# Altium project S7CAS-PLEIADES-CARTE-MERE_P20.PrjPcb (part 2 of 5)

## Sheet S7CAS-PLEIADES-CARTE-MERE_P20_DDR3-Decoupling.SchDoc
size Tabloid; SheetNumber: 7; SheetTotal: 20; Sheet_Name: DDR3 Decoupling; Size: 11x17
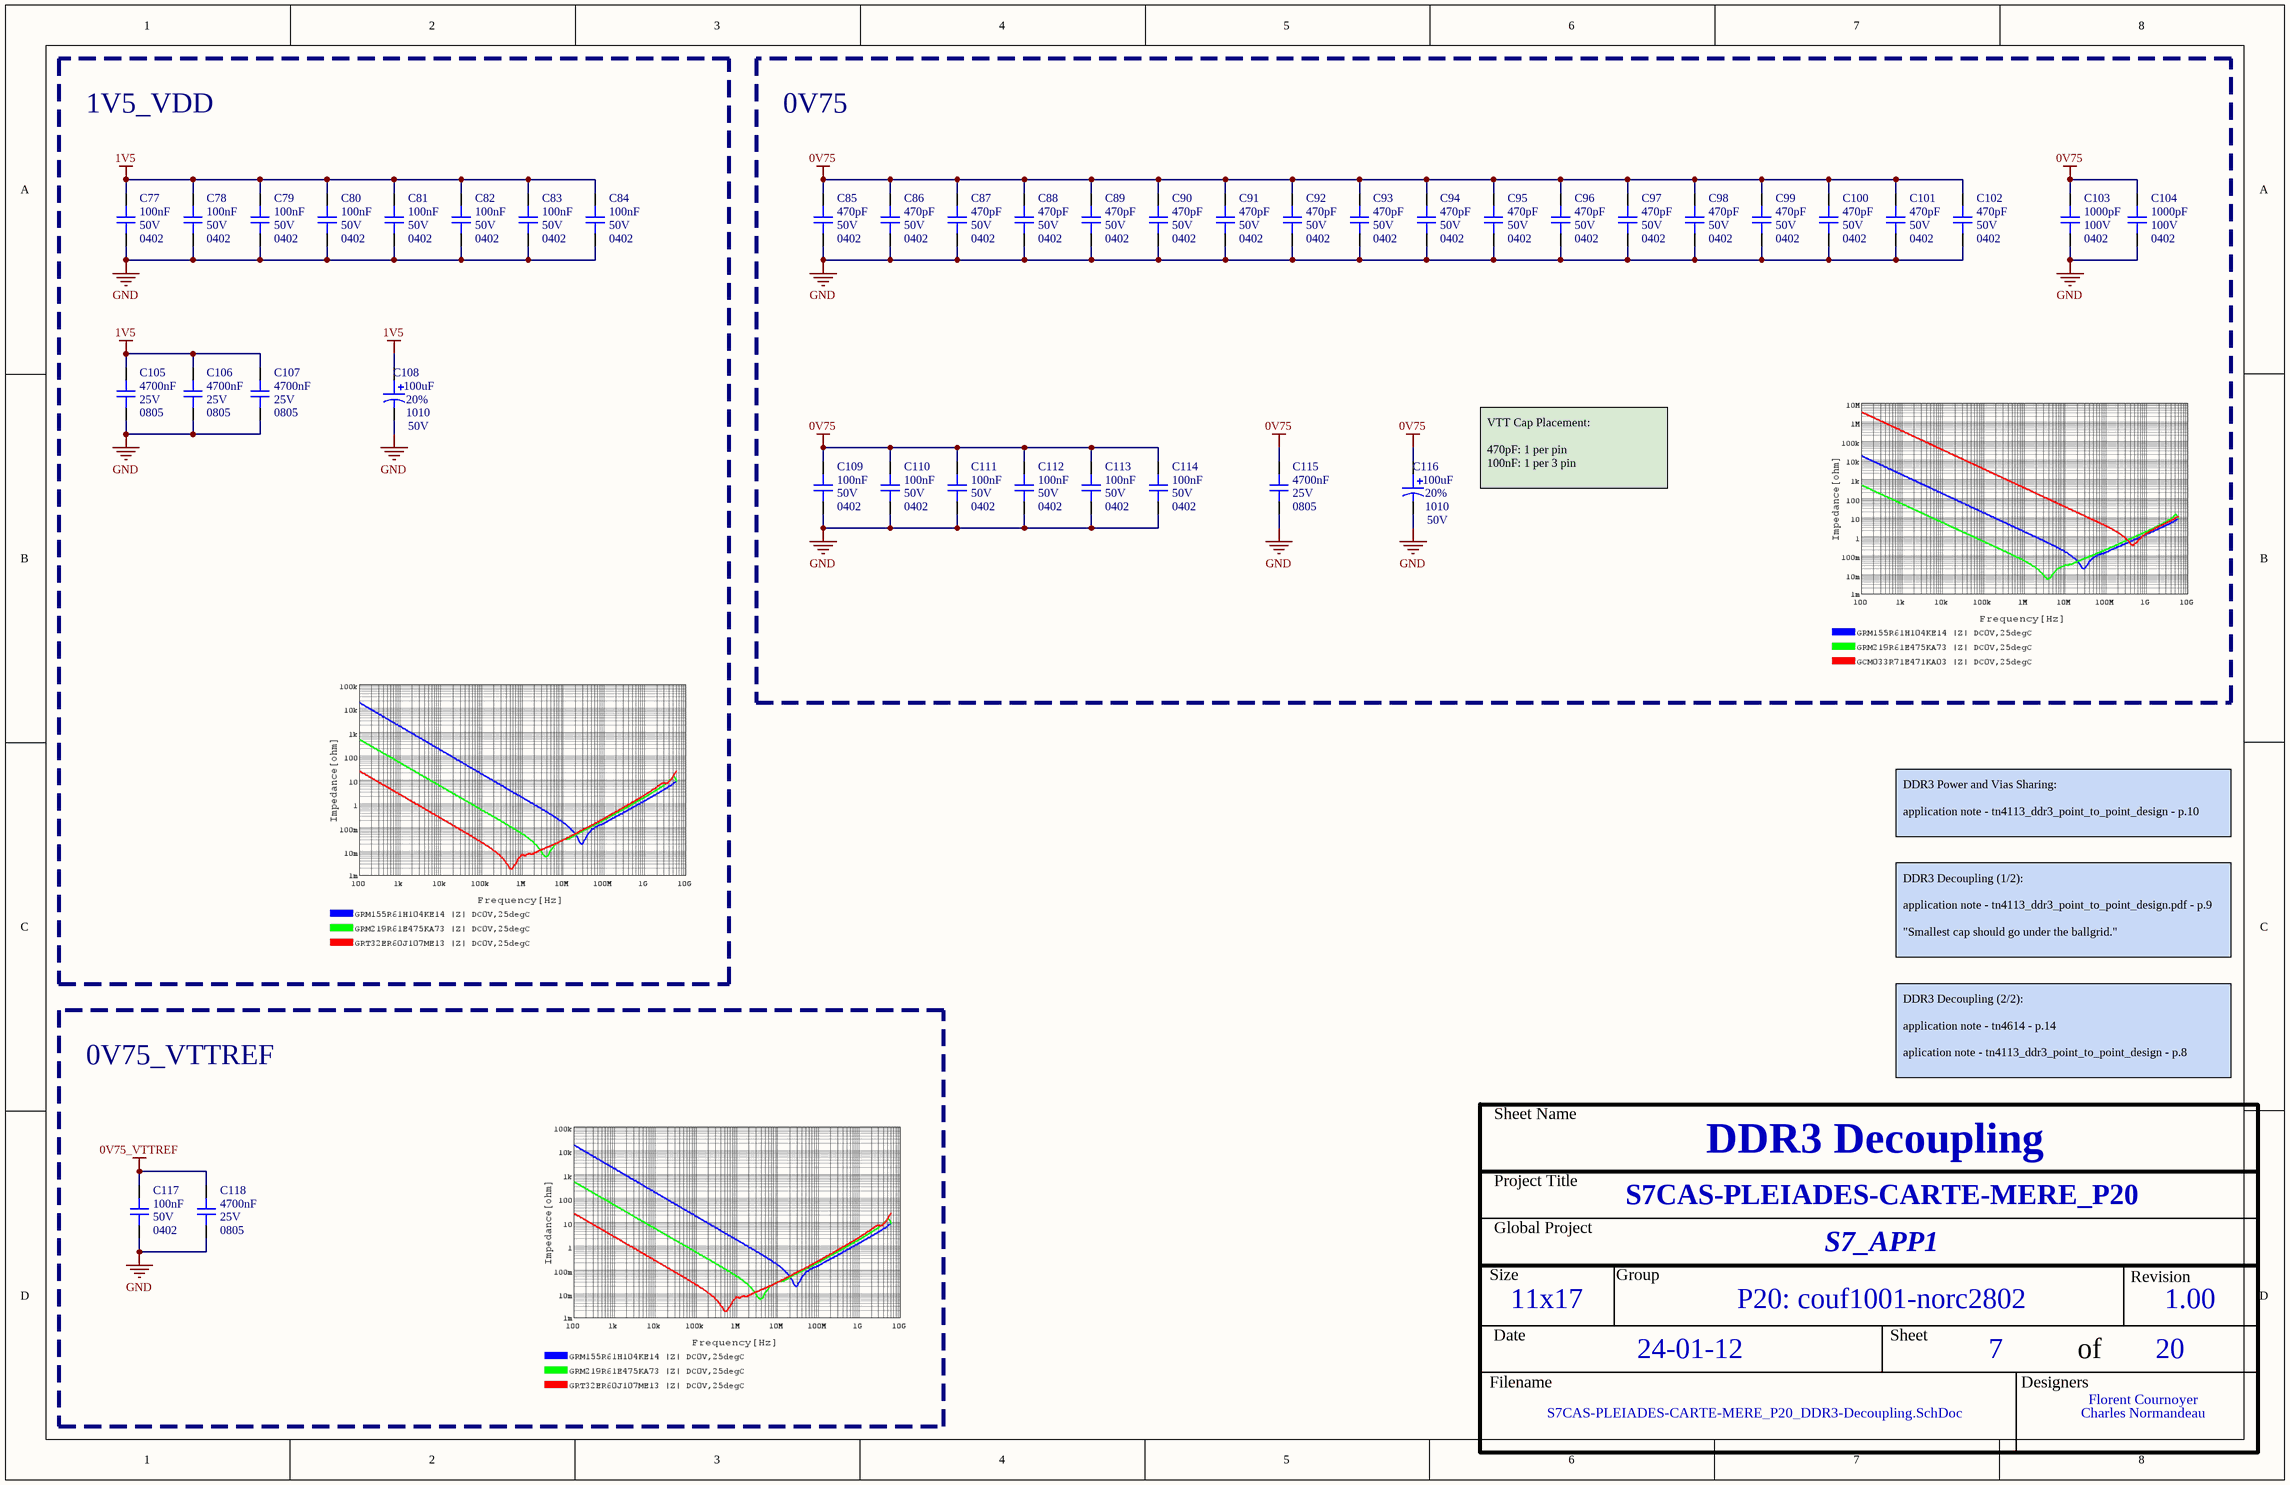
[diagram p6: S7CAS-PLEIADES-CARTE-MERE_P20_DDR3-Decoupling.SchDoc]

### Parts
C77  value 100nF  Voltage: 50V  Package: 0402  [CAP_0402]  (hidden comment: CAP - 0402)
C78  value 100nF  Voltage: 50V  Package: 0402  [CAP_0402]  (hidden comment: CAP - 0402)
C79  value 100nF  Voltage: 50V  Package: 0402  [CAP_0402]  (hidden comment: CAP - 0402)
C80  value 100nF  Voltage: 50V  Package: 0402  [CAP_0402]  (hidden comment: CAP - 0402)
C81  value 100nF  Voltage: 50V  Package: 0402  [CAP_0402]  (hidden comment: CAP - 0402)
C82  value 100nF  Voltage: 50V  Package: 0402  [CAP_0402]  (hidden comment: CAP - 0402)
C83  value 100nF  Voltage: 50V  Package: 0402  [CAP_0402]  (hidden comment: CAP - 0402)
C84  value 100nF  Voltage: 50V  Package: 0402  [CAP_0402]  (hidden comment: CAP - 0402)
C85  value 470pF  Voltage: 50V  Package: 0402  [CAP_0402]  (hidden comment: CAP - 0402)
C86  value 470pF  Voltage: 50V  Package: 0402  [CAP_0402]  (hidden comment: CAP - 0402)
C87  value 470pF  Voltage: 50V  Package: 0402  [CAP_0402]  (hidden comment: CAP - 0402)
C88  value 470pF  Voltage: 50V  Package: 0402  [CAP_0402]  (hidden comment: CAP - 0402)
C89  value 470pF  Voltage: 50V  Package: 0402  [CAP_0402]  (hidden comment: CAP - 0402)
C90  value 470pF  Voltage: 50V  Package: 0402  [CAP_0402]  (hidden comment: CAP - 0402)
C91  value 470pF  Voltage: 50V  Package: 0402  [CAP_0402]  (hidden comment: CAP - 0402)
C92  value 470pF  Voltage: 50V  Package: 0402  [CAP_0402]  (hidden comment: CAP - 0402)
C93  value 470pF  Voltage: 50V  Package: 0402  [CAP_0402]  (hidden comment: CAP - 0402)
C94  value 470pF  Voltage: 50V  Package: 0402  [CAP_0402]  (hidden comment: CAP - 0402)
C95  value 470pF  Voltage: 50V  Package: 0402  [CAP_0402]  (hidden comment: CAP - 0402)
C96  value 470pF  Voltage: 50V  Package: 0402  [CAP_0402]  (hidden comment: CAP - 0402)
C97  value 470pF  Voltage: 50V  Package: 0402  [CAP_0402]  (hidden comment: CAP - 0402)
C98  value 470pF  Voltage: 50V  Package: 0402  [CAP_0402]  (hidden comment: CAP - 0402)
C99  value 470pF  Voltage: 50V  Package: 0402  [CAP_0402]  (hidden comment: CAP - 0402)
C100  value 470pF  Voltage: 50V  Package: 0402  [CAP_0402]  (hidden comment: CAP - 0402)
C101  value 470pF  Voltage: 50V  Package: 0402  [CAP_0402]  (hidden comment: CAP - 0402)
C102  value 470pF  Voltage: 50V  Package: 0402  [CAP_0402]  (hidden comment: CAP - 0402)
C103  value 1000pF  Voltage: 100V  Package: 0402  [CAP_0402]  (hidden comment: CAP - 0402)
C104  value 1000pF  Voltage: 100V  Package: 0402  [CAP_0402]  (hidden comment: CAP - 0402)
C105  value 4700nF  Voltage: 25V  Package: 0805  [CAP_0805]  (hidden comment: CAP - 0805)
C106  value 4700nF  Voltage: 25V  Package: 0805  [CAP_0805]  (hidden comment: CAP - 0805)
C107  value 4700nF  Voltage: 25V  Package: 0805  [CAP_0805]  (hidden comment: CAP - 0805)
C108  value 100uF  Voltage: 50V  Package: 1010  Precision: 20%  [CAP_ALU_1010_vishay]  (hidden comment: MAL215099101E3)
C109  value 100nF  Voltage: 50V  Package: 0402  [CAP_0402]  (hidden comment: CAP - 0402)
C110  value 100nF  Voltage: 50V  Package: 0402  [CAP_0402]  (hidden comment: CAP - 0402)
C111  value 100nF  Voltage: 50V  Package: 0402  [CAP_0402]  (hidden comment: CAP - 0402)
C112  value 100nF  Voltage: 50V  Package: 0402  [CAP_0402]  (hidden comment: CAP - 0402)
C113  value 100nF  Voltage: 50V  Package: 0402  [CAP_0402]  (hidden comment: CAP - 0402)
C114  value 100nF  Voltage: 50V  Package: 0402  [CAP_0402]  (hidden comment: CAP - 0402)
C115  value 4700nF  Voltage: 25V  Package: 0805  [CAP_0805]  (hidden comment: CAP - 0805)
C116  value 100uF  Voltage: 50V  Package: 1010  Precision: 20%  [CAP_ALU_1010_vishay]  (hidden comment: MAL215099101E3)
C117  value 100nF  Voltage: 50V  Package: 0402  [CAP_0402]  (hidden comment: CAP - 0402)
C118  value 4700nF  Voltage: 25V  Package: 0805  [CAP_0805]  (hidden comment: CAP - 0805)

### Blocks framed on the sheet
1V5_VDD: C77-C84 C105-C108
0V75: C85-C104 C109-C116
0V75_VTTREF: C117 C118

### Nets
0V75: C85.2 C86.2 C87.2 C88.2 C89.2 C90.2 C91.2 C92.2 C93.2 C94.2 C95.2 C96.2 C97.2 C98.2 C99.2 C100.2 C101.2 C102.2 C103.2 C104.2 C109.2 C110.2 C111.2 C112.2 C113.2 C114.2 C115.2 C116.1
0V75_VTTREF: C117.2 C118.2
1V5: C77.2 C78.2 C79.2 C80.2 C81.2 C82.2 C83.2 C84.2 C105.2 C106.2 C107.2 C108.1
GND: C77.1 C78.1 C79.1 C80.1 C81.1 C82.1 C83.1 C84.1 C85.1 C86.1 C87.1 C88.1 C89.1 C90.1 C91.1 C92.1 C93.1 C94.1 C95.1 C96.1 C97.1 C98.1 C99.1 C100.1 C101.1 C102.1 C103.1 C104.1 C105.1 C106.1 C107.1 C108.2 C109.1 C110.1 C111.1 C112.1 C113.1 C114.1 C115.1 C116.2 C117.1 C118.1

### Notes on the sheet
- VTT Cap Placement:
  470pF: 1 per pin
  100nF: 1 per 3 pin
- DDR3 Power and Vias Sharing:
  application note - tn4113_ddr3_point_to_point_design - p.10
- DDR3 Decoupling (1/2):
  application note - tn4113_ddr3_point_to_point_design.pdf - p.9
  "Smallest cap should go under the ballgrid."
- DDR3 Decoupling (2/2):
  application note - tn4614 - p.14
  aplication note - tn4113_ddr3_point_to_point_design - p.8
- Sheet Name
- Project Title
- Global Project
- Size
- Group
- Revision
- Date
- Sheet
- of
- Filename
- Designers

### Library data of the parts
C77-C84 C109-C114 C117 = CAP - 0402: Mfg Part Number: GRM155R61H104KE14; Precision: 10%; Current: *; CreatedBy: Jonathan Bouchard; Power: *
C85-C102 = CAP - 0402: Mfg Part Number: GRM1555C1H471GA01; Precision: 2%; Current: *; HelpURL: https://search.murata.co.jp/Ceramy/image/img/A01X/G101/ENG/GRM1555C1H471GA01-01.pdf; CreatedBy: Jonathan Bouchard; Power: *
C103 C104 = CAP - 0402: Mfg Part Number: GRM155R72A102KA01; Precision: 10%; Current: *; CreatedBy: Jonathan Bouchard; Power: *
C105-C107 C115 C118 = CAP - 0805: as C29 on sheet S7CAS-PLEIADES-CARTE-MERE_P20_Power-Tree-2; Current: *; CreatedBy: Jonathan Bouchard; Power: *
C108 C116 = CAP_ALU_MAL215099101E3: as C5 on sheet S7CAS-PLEIADES-CARTE-MERE_P20_Power-Tree-1; Mfg Part Number: MAL215099101E3; HelpURL: http://www.vishay.com/docs/28395/150crz.pdf; CreatedBy: Jonathan Bouchard; Temperature: -55°C to 125°C; Power: *; Supplier 1: Digikey; Supplier Part Number 1: 4399PHDKR-ND

## Sheet S7CAS-PLEIADES-CARTE-MERE_P20_Flash-Sensors-FPGA-bank-2.SchDoc
size Tabloid; SheetNumber: 8; SheetTotal: 20; Sheet_Name: Flash Sensors FPGA Bank 2; Size: 11x17
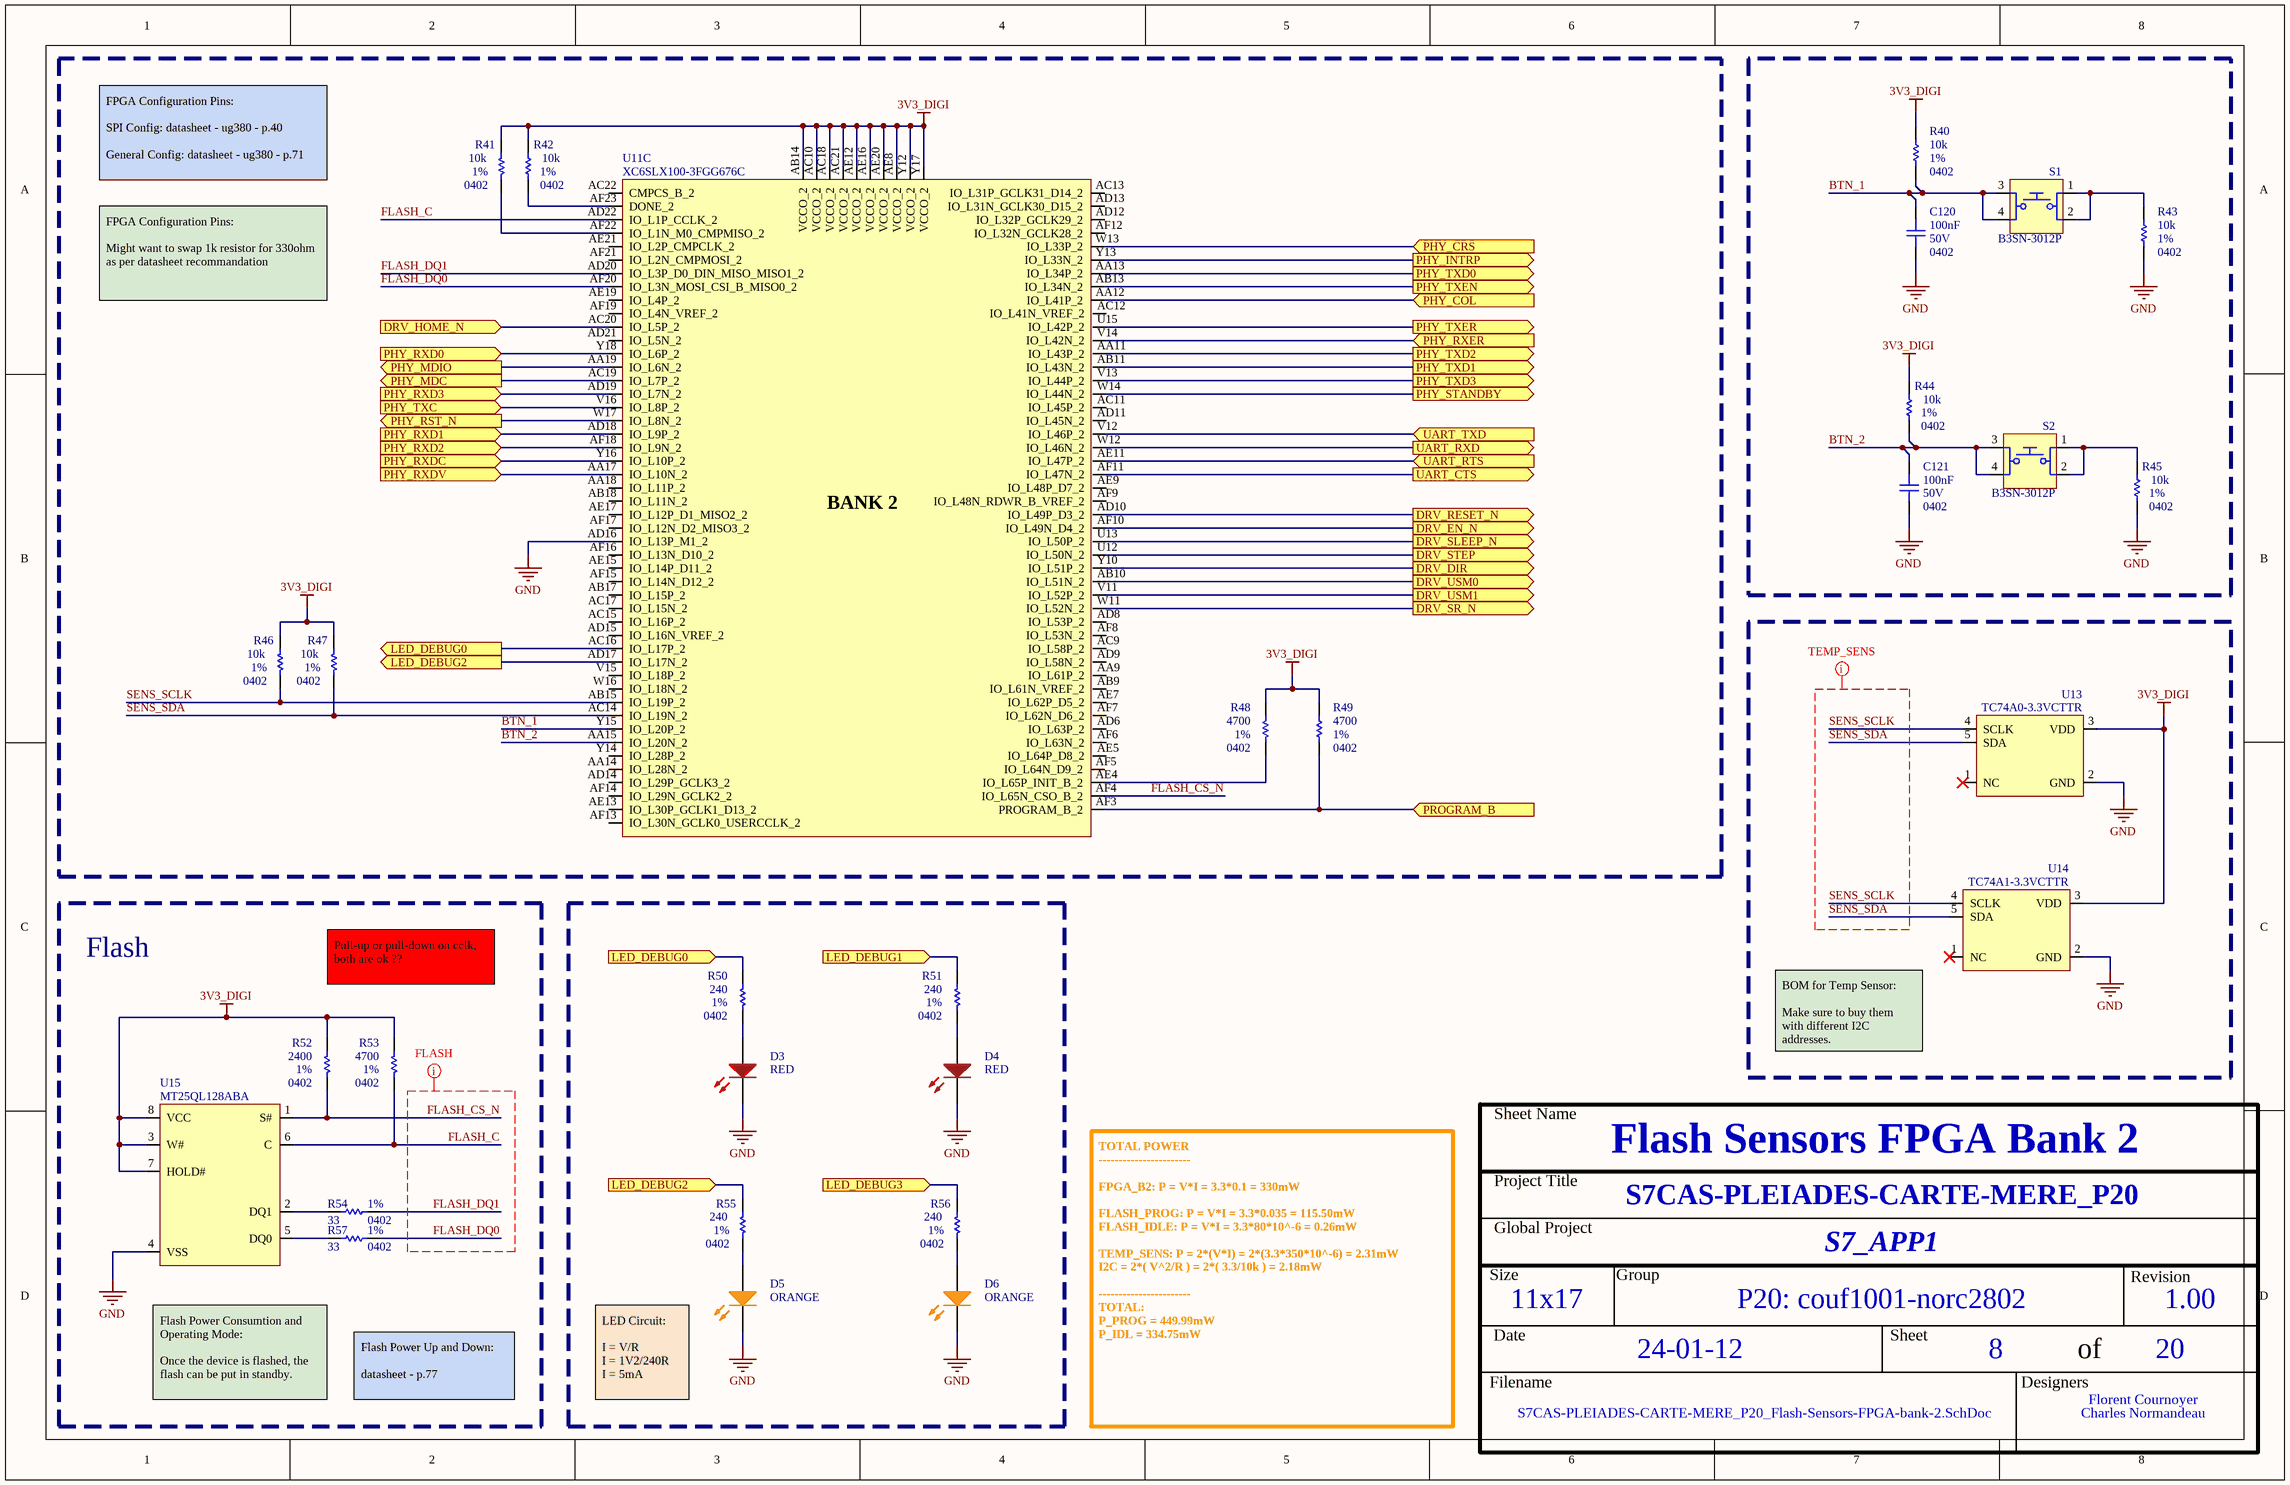
[diagram p7: S7CAS-PLEIADES-CARTE-MERE_P20_Flash-Sensors-FPGA-bank-2.SchDoc]

### Parts
C120  value 100nF  Voltage: 50V  Package: 0402  [CAP_0402]  (hidden comment: CAP - 0402)
C121  value 100nF  Voltage: 50V  Package: 0402  [CAP_0402]  (hidden comment: CAP - 0402)
D3  value RED  [LED_0603]  (hidden comment: SML-311UTT86)
D4  value RED  [LED_0603]  (hidden comment: SML-311UTT86)
D5  value ORANGE  [LED_0603]  (hidden comment: SML-311DTT86)
D6  value ORANGE  [LED_0603]  (hidden comment: SML-311DTT86)
R40  value 10k  Package: 0402  Precision: 1%  [RES_0402]  (hidden comment: RES - 0402)
R41  value 10k  Package: 0402  Precision: 1%  [RES_0402]  (hidden comment: RES - 0402)
R42  value 10k  Package: 0402  Precision: 1%  [RES_0402]  (hidden comment: RES - 0402)
R43  value 10k  Package: 0402  Precision: 1%  [RES_0402]  (hidden comment: RES - 0402)
R44  value 10k  Package: 0402  Precision: 1%  [RES_0402]  (hidden comment: RES - 0402)
R45  value 10k  Package: 0402  Precision: 1%  [RES_0402]  (hidden comment: RES - 0402)
R46  value 10k  Package: 0402  Precision: 1%  [RES_0402]  (hidden comment: RES - 0402)
R47  value 10k  Package: 0402  Precision: 1%  [RES_0402]  (hidden comment: RES - 0402)
R48  value 4700  Package: 0402  Precision: 1%  [RES_0402]  (hidden comment: RES - 0402)
R49  value 4700  Package: 0402  Precision: 1%  [RES_0402]  (hidden comment: RES - 0402)
R50  value 240  Package: 0402  Precision: 1%  [RES_0402]  (hidden comment: RES - 0402)
R51  value 240  Package: 0402  Precision: 1%  [RES_0402]  (hidden comment: RES - 0402)
R52  value 2400  Package: 0402  Precision: 1%  [RES_0402]  (hidden comment: RES - 0402)
R53  value 4700  Package: 0402  Precision: 1%  [RES_0402]  (hidden comment: RES - 0402)
R54  value 33  Package: 0402  Precision: 1%  [RES_0402]  (hidden comment: RES - 0402)
R55  value 240  Package: 0402  Precision: 1%  [RES_0402]  (hidden comment: RES - 0402)
R56  value 240  Package: 0402  Precision: 1%  [RES_0402]  (hidden comment: RES - 0402)
R57  value 33  Package: 0402  Precision: 1%  [RES_0402]  (hidden comment: RES - 0402)
S1  B3SN-3012P  [SWI_TACT_B3SN-3012P]
S2  B3SN-3012P  [SWI_TACT_B3SN-3012P]
U11  XC6SLX100-3FGG676C  [FPGA_XILINX_FGG676]  (part C of 10)
U13  TC74A0-3.3VCTTR  [SEN_TEMP_TC74A0-3.3VCTTR]
U14  TC74A1-3.3VCTTR  [SEN_TEMP_TC74A0-3.3VCTTR]
U15  MT25QL128ABA  [FLASH_MT25QL128ABA]

### Blocks framed on the sheet
Flash: R52-R54 R57 U15

### Ports
DRV_DIR (out), DRV_EN_N (out), DRV_HOME_N (in), DRV_RESET_N (out), DRV_SLEEP_N (out), DRV_SR_N (out), DRV_STEP (out), DRV_USM0 (out), DRV_USM1 (out), LED_DEBUG0 (in), LED_DEBUG0 (out), LED_DEBUG1 (in), LED_DEBUG2 (in), LED_DEBUG2 (out), LED_DEBUG3 (in), PHY_COL (in), PHY_CRS (in), PHY_INTRP (out), PHY_MDC (out), PHY_MDIO (out), PHY_RST_N (out), PHY_RXD0 (in), PHY_RXD1 (in), PHY_RXD2 (in), PHY_RXD3 (in), PHY_RXDC (in), PHY_RXDV (in), PHY_RXER (in), PHY_STANDBY (out), PHY_TXC (in), PHY_TXD0 (out), PHY_TXD1 (out), PHY_TXD2 (out), PHY_TXD3 (out), PHY_TXEN (out), PHY_TXER (out), PROGRAM_B (in), UART_CTS (out), UART_RTS (in), UART_RXD (out), UART_TXD (in)

### Nets
3V3_DIGI: R40.2 R41.2 R42.2 R44.2 R46.2 R47.2 R48.2 R49.2 R52.2 R53.2 U11.AB14(VCCO_2) U11.AC10(VCCO_2) U11.AC18(VCCO_2) U11.AC21(VCCO_2) U11.AE8(VCCO_2) U11.AE12(VCCO_2) U11.AE16(VCCO_2) U11.AE20(VCCO_2) U11.Y12(VCCO_2) U11.Y17(VCCO_2) U13.3(VDD) U14.3(VDD) U15.3(W#) U15.7(HOLD#) U15.8(VCC)
GND: C120.1 C121.1 D3.K D4.K D5.K D6.K R43.1 R45.1 U11.AD16(IO_L13P_M1_2) U13.2(GND) U14.2(GND) U15.4(VSS)
BTN_1: C120.2 R40.1 S1.3 S1.4 U11.Y15(IO_L20P_2)
BTN_2: C121.2 R44.1 S2.3 S2.4 U11.AA15(IO_L20N_2)
DRV_DIR: U11.Y10(IO_L51P_2) ; port DRV_DIR
DRV_EN_N: U11.AF10(IO_L49N_D4_2) ; port DRV_EN_N
DRV_HOME_N: U11.AC20(IO_L5P_2) ; port DRV_HOME_N
DRV_RESET_N: U11.AD10(IO_L49P_D3_2) ; port DRV_RESET_N
DRV_SLEEP_N: U11.U13(IO_L50P_2) ; port DRV_SLEEP_N
DRV_SR_N: U11.W11(IO_L52N_2) ; port DRV_SR_N
DRV_STEP: U11.U12(IO_L50N_2) ; port DRV_STEP
DRV_USM0: U11.AB10(IO_L51N_2) ; port DRV_USM0
DRV_USM1: U11.V11(IO_L52P_2) ; port DRV_USM1
FLASH_C: R53.1 U11.AD22(IO_L1P_CCLK_2) U15.6(C)
FLASH_CS_N: R52.1 U11.AF4(IO_L65N_CSO_B_2) U15.1(S#)
FLASH_DQ0: R57.1 U11.AF20(IO_L3N_MOSI_CSI_B_MISO0_2)
FLASH_DQ1: R54.1 U11.AD20(IO_L3P_D0_DIN_MISO_MISO1_2)
LED_DEBUG0: R50.2 U11.AC16(IO_L17P_2) ; port LED_DEBUG0
LED_DEBUG1: R51.2 ; port LED_DEBUG1
LED_DEBUG2: R55.2 U11.AD17(IO_L17N_2) ; port LED_DEBUG2
LED_DEBUG3: R56.2 ; port LED_DEBUG3
PHY_COL: U11.AA12(IO_L41P_2) ; port PHY_COL
PHY_CRS: U11.W13(IO_L33P_2) ; port PHY_CRS
PHY_INTRP: U11.Y13(IO_L33N_2) ; port PHY_INTRP
PHY_MDC: U11.AC19(IO_L7P_2) ; port PHY_MDC
PHY_MDIO: U11.AA19(IO_L6N_2) ; port PHY_MDIO
PHY_RST_N: U11.W17(IO_L8N_2) ; port PHY_RST_N
PHY_RXD0: U11.Y18(IO_L6P_2) ; port PHY_RXD0
PHY_RXD1: U11.AD18(IO_L9P_2) ; port PHY_RXD1
PHY_RXD2: U11.AF18(IO_L9N_2) ; port PHY_RXD2
PHY_RXD3: U11.AD19(IO_L7N_2) ; port PHY_RXD3
PHY_RXDC: U11.Y16(IO_L10P_2) ; port PHY_RXDC
PHY_RXDV: U11.AA17(IO_L10N_2) ; port PHY_RXDV
PHY_RXER: U11.V14(IO_L42N_2) ; port PHY_RXER
PHY_STANDBY: U11.W14(IO_L44N_2) ; port PHY_STANDBY
PHY_TXC: U11.V16(IO_L8P_2) ; port PHY_TXC
PHY_TXD0: U11.AA13(IO_L34P_2) ; port PHY_TXD0
PHY_TXD1: U11.AB11(IO_L43N_2) ; port PHY_TXD1
PHY_TXD2: U11.AA11(IO_L43P_2) ; port PHY_TXD2
PHY_TXD3: U11.V13(IO_L44P_2) ; port PHY_TXD3
PHY_TXEN: U11.AB13(IO_L34N_2) ; port PHY_TXEN
PHY_TXER: U11.U15(IO_L42P_2) ; port PHY_TXER
PROGRAM_B: R49.1 U11.AF3(PROGRAM_B_2) ; port PROGRAM_B
SENS_SCLK: R46.1 U11.AB15(IO_L19P_2) U13.4(SCLK) U14.4(SCLK)
SENS_SDA: R47.1 U11.AC14(IO_L19N_2) U13.5(SDA) U14.5(SDA)
UART_CTS: U11.AF11(IO_L47N_2) ; port UART_CTS
UART_RTS: U11.AE11(IO_L47P_2) ; port UART_RTS
UART_RXD: U11.W12(IO_L46N_2) ; port UART_RXD
UART_TXD: U11.V12(IO_L46P_2) ; port UART_TXD
NetD3_A: D3.A R50.1
NetD4_A: D4.A R51.1
NetD5_A: D5.A R55.1
NetD6_A: D6.A R56.1
NetR41_1: R41.1 U11.AF22(IO_L1N_M0_CMPMISO_2)
NetR42_1: R42.1 U11.AF23(DONE_2)
NetR43_2: R43.2 S1.1 S1.2
NetR45_2: R45.2 S2.1 S2.2
NetR48_1: R48.1 U11.AE4(IO_L65P_INIT_B_2)
NetR54_2: R54.2 U15.2(DQ1)
NetR57_2: R57.2 U15.5(DQ0)

Not connected (* = marked no-connect by the designer): U11 AA9(IO_L61P_2) AA14(IO_L28N_2) AA18(IO_L11P_2) AB9(IO_L61N_VREF_2) AB17(IO_L15P_2) AB18(IO_L11N_2) AC9(IO_L58P_2) AC11(IO_L45P_2) AC12(IO_L41N_VREF_2) AC13(IO_L31P_GCLK31_D14_2) AC15(IO_L16P_2) AC17(IO_L15N_2) AC22(CMPCS_B_2) AD6(IO_L63P_2) AD8(IO_L53P_2) AD9(IO_L58N_2) AD11(IO_L45N_2) AD12(IO_L32P_GCLK29_2) AD13(IO_L31N_GCLK30_D15_2) AD14(IO_L29P_GCLK3_2) AD15(IO_L16N_VREF_2) AD21(IO_L5N_2) AE5(IO_L64P_D8_2) AE7(IO_L62P_D5_2) AE9(IO_L48P_D7_2) AE13(IO_L30P_GCLK1_D13_2) AE15(IO_L14P_D11_2) AE17(IO_L12P_D1_MISO2_2) AE19(IO_L4P_2) AE21(IO_L2P_CMPCLK_2) AF5(IO_L64N_D9_2) AF6(IO_L63N_2) AF7(IO_L62N_D6_2) AF8(IO_L53N_2) AF9(IO_L48N_RDWR_B_VREF_2) AF12(IO_L32N_GCLK28_2) AF13(IO_L30N_GCLK0_USERCCLK_2) AF14(IO_L29N_GCLK2_2) AF15(IO_L14N_D12_2) AF16(IO_L13N_D10_2) AF17(IO_L12N_D2_MISO3_2) AF19(IO_L4N_VREF_2) AF21(IO_L2N_CMPMOSI_2) V15(IO_L18P_2) W16(IO_L18N_2) Y14(IO_L28P_2); U13 1(NC)*; U14 1(NC)*

### Layout directives
net class TRACKS_50: FLASH_C, FLASH_CS_N, FLASH_DQ0, FLASH_DQ1, SENS_SCLK, SENS_SDA

### Notes on the sheet
- FPGA Configuration Pins:
  SPI Config: datasheet - ug380 - p.40
  General Config: datasheet - ug380 - p.71
- FPGA Configuration Pins:
  Might want to swap 1k resistor for 330ohm as per datasheet recommandation
- Pull-up or pull-down on cclk, both are ok ??
- (near U14) BOM for Temp Sensor:
  Make sure to buy them with different I2C addresses.
- Flash Power Consumtion and Operating Mode:
  Once the device is flashed, the flash can be put in standby.
- Flash Power Up and Down:
  datasheet - p.77
- LED Circuit:
  I = V/R
  I = 1V2/240R
  I = 5mA
- TOTAL POWER
  -----------------------
  FPGA_B2: P = V*I = 3.3*0.1 = 330mW
  FLASH_PROG: P = V*I = 3.3*0.035 = 115.50mW
  FLASH_IDLE: P = V*I = 3.3*80*10^-6 = 0.26mW
  TEMP_SENS: P = 2*(V*I) = 2*(3.3*350*10^-6) = 2.31mW
  I2C = 2*( V^2/R ) = 2*( 3.3/10k ) = 2.18mW
  -----------------------
  TOTAL:
  P_PROG = 449.99mW
  P_IDL = 334.75mW
- Sheet Name
- Project Title
- Global Project
- Size
- Group
- Revision
- Date
- Sheet
- of
- Filename
- Designers
- (in symbol FPGA_XC6SLX100-3FGG676C, part C) BANK 2

### Library data of the parts
C120 C121 = CAP - 0402: as C77 on sheet S7CAS-PLEIADES-CARTE-MERE_P20_DDR3-Decoupling; Current: *; CreatedBy: Jonathan Bouchard; Power: *
D3 D4 = LED_SML-311UTT86: LED - 620nM RED 2mA - 0603; Voltage: 1.8V; Mfg: ROHM Semiconductor; Power: 44mW; Current: 2mA; HelpURL: http://media.digikey.com/pdf/Data%20Sheets/Rohm%20PDFs/SML-311%20Series.pdf; CreatedBy: Jonathan Bouchard; Temperature: -30°C to 85°C; Package: 0603; Precision: *; Mfg Part Number: SML-311UTT86; Supplier 1: Digikey; Supplier Part Number 1: 511-1304-1-ND
D5 D6 = LED_SML-311DTT86: LED - 611nM ORANGE 2mA - 0603; Voltage: 1.8V; Mfg: ROHM Semiconductor; Power: 44mW; Current: 2mA; HelpURL: http://media.digikey.com/pdf/Data%20Sheets/Rohm%20PDFs/SML-311%20Series.pdf; CreatedBy: Jonathan Bouchard; Temperature: -40°C to 85°C; Package: 0603; Precision: *; Mfg Part Number: SML-311DTT86; Supplier 1: Digikey; Supplier Part Number 1: 511-1303-1-ND
R40-R47 = RES - 0402: Mfg Part Number: MCS04020C1002FE000; Voltage: 50V; Power: 1/16W; Current: *; CreatedBy: Jonathan Bouchard
R48 R49 R53 = RES - 0402: Mfg Part Number: TBD; Voltage: 50V; Power: 1/16W; Current: *; CreatedBy: Jonathan Bouchard
R50 R51 R55 R56 = RES - 0402: Mfg Part Number: ERA-2AEB241X; Voltage: 50V; Power: 1/2W; Current: *; CreatedBy: Jonathan Bouchard
R52 = RES - 0402: Voltage: 50V; Power: 1/16W; Current: *; CreatedBy: Jonathan Bouchard
R54 R57 = RES - 0402: Mfg Part Number: CRCW040233R0FKEDC; Voltage: 50V; Power: 1/16W; Current: *; CreatedBy: Jonathan Bouchard
S1 S2 = SWI_TACT_B3SN-3012P_1: SWI - SWITCH TACTILE SPST-NO 0.05A 24V -SMD; Manufacturer #1: Omron Electronics Inc-EMC Div; Current Rating: 50mA; Voltage rating: 24VDC; Polarized: No; Magnetic Material: UNKNOWN; GRAMS Lib Spec: 2.8; Manufacturer #2: *; Power Max: *; Value: SPST-NO; Part Number #1: B3SN-3012P; Part Number #2: *; HelpURL: http://omronfs.omron.com/en_US/ecb/products/pdf/en-b3sn.pdf; Supplier 1: Digi-Key; Supplier Part Number 1: SW261CT-ND; Assembly Type: SMD; Temperature: -25°C ~ 70°C; Package: SMD; CreatedBy/Date: Olivier Bernard / 5/12/2017; Tolerance: *; VerifiedBy: Caroline Paulin / 11 juillet 2018; Cryo: UNKNOWN; Mfg Part Number: B3SN-3012P
U11 = FPGA_XC6SLX100-3FGG676C: as U11 on sheet S7CAS-PLEIADES-CARTE-MERE_P20_DDR3-FPGA-Bank-3; Current: *; Power: *; Mfg: Xilinx; Mfg Part Number: XC6SLX100-3FGG676C; HelpURL: https://www.xilinx.com/support/documentation/data_sheets/ds162.pdf; CreatedBy: Jonathan Bouchard; Temperature: 0°C ~ 85°C (TJ); Value: *; Precision: *; Package: BGA-676; Supplier 1: Digikey; Supplier Part Number 1: 122-1760-ND
U13 U14 = SENS_TEMP_TC74A0-3.3VCTTR: SENS - TEMPERATURE SENSOR I2C/SMBUS - SOT23-5; Voltage: 2.7 V ~ 5.5 V; Mfg: Microchip; Precision: ±2°C (±3°C); Current: *; Power: *; Mfg Part Number: TC74A0-3.3VCTTR; HelpURL: http://ww1.microchip.com/downloads/en/DeviceDoc/21462D.pdf; CreatedBy: Jonathan Bouchard; Temperature: -40°C ~ 125°C; Value: *; Package: SOT23-5; Supplier 1: Digikey; Supplier Part Number 1: TC74A0-3.3VCTDKR-ND
U15 = FLASH_MT25QL128ABA: MT25QL128ABA - 128Mb, 3V Multiple I/O Serial Flash Memory - Package code : SE; Manufacturer #1: Micron; Voltage Rating: 2V7 - 3V6; GRAMS Lib Spec: 2.7; HelpURL: https://media-www.micron.com/-/media/client/global/documents/products/data-sheet/nor-flash/serial-nor/mt25q/die-rev-a/mt25q_qlhs_l_128_aba_0.pdf; Supplier 1: Digikey; Supplier Part Number 1: MT25QL128ABA1ESE-0SIT TR

## Sheet S7CAS-PLEIADES-CARTE-MERE_P20_Mechanical-FPGA-Bank-0.SchDoc
size Tabloid; SheetNumber: 9; SheetTotal: 20; Sheet_Name: Mechanical FPGA Bank 0; Size: 11x17
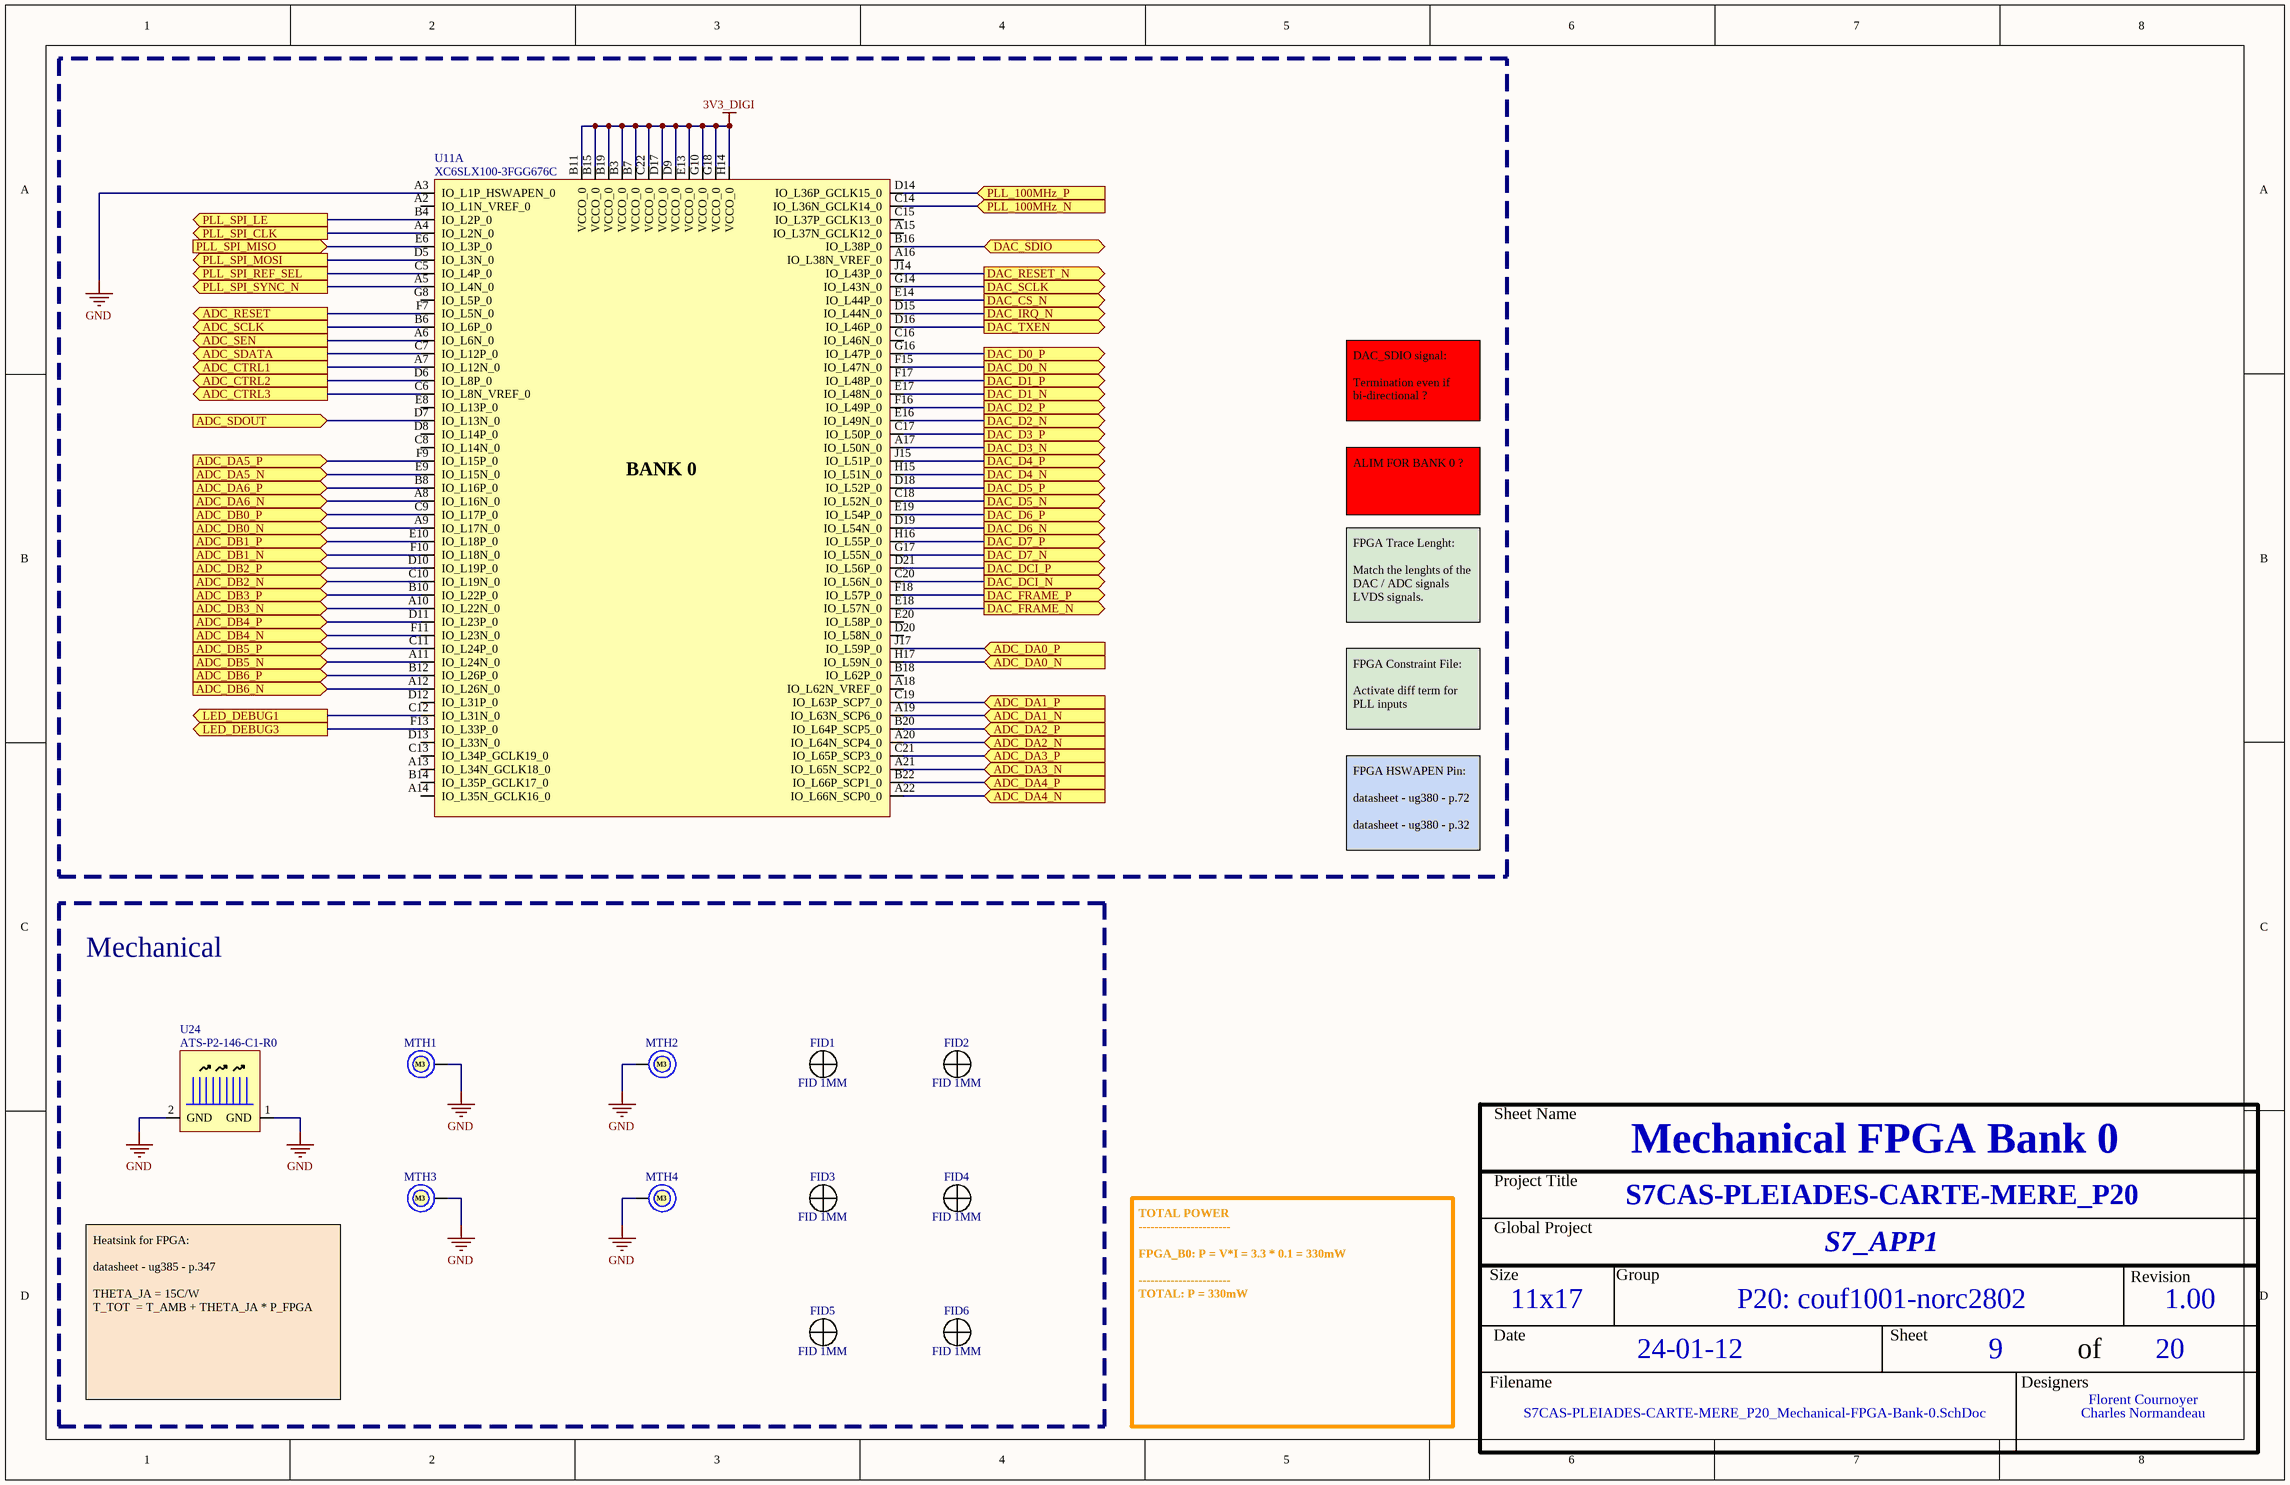
[diagram p8: S7CAS-PLEIADES-CARTE-MERE_P20_Mechanical-FPGA-Bank-0.SchDoc]

### Parts
FID1  FID 1MM  [FID_CIRCLE_1MM]
FID2  FID 1MM  [FID_CIRCLE_1MM]
FID3  FID 1MM  [FID_CIRCLE_1MM]
FID4  FID 1MM  [FID_CIRCLE_1MM]
FID5  FID 1MM  [FID_CIRCLE_1MM]
FID6  FID 1MM  [FID_CIRCLE_1MM]
MTH1  M3  [MTH_M3]  (no BOM)
MTH2  M3  [MTH_M3]  (no BOM)
MTH3  M3  [MTH_M3]  (no BOM)
MTH4  M3  [MTH_M3]  (no BOM)
U11  XC6SLX100-3FGG676C  [FPGA_XILINX_FGG676]  (part A of 10)
U24  ATS-P2-146-C1-R0  [HEATSINK]

### Blocks framed on the sheet
Mechanical: FID1-FID6 MTH1-MTH4 U24

### Ports
ADC_CTRL1 (out), ADC_CTRL2 (out), ADC_CTRL3 (out), ADC_DA0_N (in), ADC_DA0_P (in), ADC_DA1_N (in), ADC_DA1_P (in), ADC_DA2_N (in), ADC_DA2_P (in), ADC_DA3_N (in), ADC_DA3_P (in), ADC_DA4_N (in), ADC_DA4_P (in), ADC_DA5_N (in), ADC_DA5_P (in), ADC_DA6_N (in), ADC_DA6_P (in), ADC_DB0_N (in), ADC_DB0_P (in), ADC_DB1_N (in), ADC_DB1_P (in), ADC_DB2_N (in), ADC_DB2_P (in), ADC_DB3_N (in), ADC_DB3_P (in), ADC_DB4_N (in), ADC_DB4_P (in), ADC_DB5_N (in), ADC_DB5_P (in), ADC_DB6_N (in), ADC_DB6_P (in), ADC_RESET (out), ADC_SCLK (out), ADC_SDATA (out), ADC_SDOUT (in), ADC_SEN (out), DAC_CS_N (out), DAC_D0_N (out), DAC_D0_P (out), DAC_D1_N (out), DAC_D1_P (out), DAC_D2_N (out), DAC_D2_P (out), DAC_D3_N (out), DAC_D3_P (out), DAC_D4_N (out), DAC_D4_P (out), DAC_D5_N (out), DAC_D5_P (out), DAC_D6_N (out), DAC_D6_P (out), DAC_D7_N (out), DAC_D7_P (out), DAC_DCI_N (out), DAC_DCI_P (out), DAC_FRAME_N (out), DAC_FRAME_P (out), DAC_IRQ_N (out), DAC_RESET_N (out), DAC_SCLK (out), DAC_SDIO (bidir), DAC_TXEN (out), LED_DEBUG1 (out), LED_DEBUG3 (out), PLL_100MHz_N (in), PLL_100MHz_P (in), PLL_SPI_CLK (out), PLL_SPI_LE (out), PLL_SPI_MISO (in), PLL_SPI_MOSI (out), PLL_SPI_REF_SEL (out), PLL_SPI_SYNC_N (out)

### Nets
3V3_DIGI: U11.B3(VCCO_0) U11.B7(VCCO_0) U11.B11(VCCO_0) U11.B15(VCCO_0) U11.B19(VCCO_0) U11.C22(VCCO_0) U11.D9(VCCO_0) U11.D17(VCCO_0) U11.E13(VCCO_0) U11.G10(VCCO_0) U11.G18(VCCO_0) U11.H14(VCCO_0)
GND: MTH1.1 MTH2.1 MTH3.1 MTH4.1 U11.A3(IO_L1P_HSWAPEN_0) U24.1(GND) U24.2(GND)
ADC_CTRL1: U11.A7(IO_L12N_0) ; port ADC_CTRL1
ADC_CTRL2: U11.D6(IO_L8P_0) ; port ADC_CTRL2
ADC_CTRL3: U11.C6(IO_L8N_VREF_0) ; port ADC_CTRL3
ADC_DA0_N: U11.H17(IO_L59N_0) ; port ADC_DA0_N
ADC_DA0_P: U11.J17(IO_L59P_0) ; port ADC_DA0_P
ADC_DA1_N: U11.A19(IO_L63N_SCP6_0) ; port ADC_DA1_N
ADC_DA1_P: U11.C19(IO_L63P_SCP7_0) ; port ADC_DA1_P
ADC_DA2_N: U11.A20(IO_L64N_SCP4_0) ; port ADC_DA2_N
ADC_DA2_P: U11.B20(IO_L64P_SCP5_0) ; port ADC_DA2_P
ADC_DA3_N: U11.A21(IO_L65N_SCP2_0) ; port ADC_DA3_N
ADC_DA3_P: U11.C21(IO_L65P_SCP3_0) ; port ADC_DA3_P
ADC_DA4_N: U11.A22(IO_L66N_SCP0_0) ; port ADC_DA4_N
ADC_DA4_P: U11.B22(IO_L66P_SCP1_0) ; port ADC_DA4_P
ADC_DA5_N: U11.E9(IO_L15N_0) ; port ADC_DA5_N
ADC_DA5_P: U11.F9(IO_L15P_0) ; port ADC_DA5_P
ADC_DA6_N: U11.A8(IO_L16N_0) ; port ADC_DA6_N
ADC_DA6_P: U11.B8(IO_L16P_0) ; port ADC_DA6_P
ADC_DB0_N: U11.A9(IO_L17N_0) ; port ADC_DB0_N
ADC_DB0_P: U11.C9(IO_L17P_0) ; port ADC_DB0_P
ADC_DB1_N: U11.F10(IO_L18N_0) ; port ADC_DB1_N
ADC_DB1_P: U11.E10(IO_L18P_0) ; port ADC_DB1_P
ADC_DB2_N: U11.C10(IO_L19N_0) ; port ADC_DB2_N
ADC_DB2_P: U11.D10(IO_L19P_0) ; port ADC_DB2_P
ADC_DB3_N: U11.A10(IO_L22N_0) ; port ADC_DB3_N
ADC_DB3_P: U11.B10(IO_L22P_0) ; port ADC_DB3_P
ADC_DB4_N: U11.F11(IO_L23N_0) ; port ADC_DB4_N
ADC_DB4_P: U11.D11(IO_L23P_0) ; port ADC_DB4_P
ADC_DB5_N: U11.A11(IO_L24N_0) ; port ADC_DB5_N
ADC_DB5_P: U11.C11(IO_L24P_0) ; port ADC_DB5_P
ADC_DB6_N: U11.A12(IO_L26N_0) ; port ADC_DB6_N
ADC_DB6_P: U11.B12(IO_L26P_0) ; port ADC_DB6_P
ADC_RESET: U11.F7(IO_L5N_0) ; port ADC_RESET
ADC_SCLK: U11.B6(IO_L6P_0) ; port ADC_SCLK
ADC_SDATA: U11.C7(IO_L12P_0) ; port ADC_SDATA
ADC_SDOUT: U11.D7(IO_L13N_0) ; port ADC_SDOUT
ADC_SEN: U11.A6(IO_L6N_0) ; port ADC_SEN
DAC_CS_N: U11.E14(IO_L44P_0) ; port DAC_CS_N
DAC_D0_N: U11.F15(IO_L47N_0) ; port DAC_D0_N
DAC_D0_P: U11.G16(IO_L47P_0) ; port DAC_D0_P
DAC_D1_N: U11.E17(IO_L48N_0) ; port DAC_D1_N
DAC_D1_P: U11.F17(IO_L48P_0) ; port DAC_D1_P
DAC_D2_N: U11.E16(IO_L49N_0) ; port DAC_D2_N
DAC_D2_P: U11.F16(IO_L49P_0) ; port DAC_D2_P
DAC_D3_N: U11.A17(IO_L50N_0) ; port DAC_D3_N
DAC_D3_P: U11.C17(IO_L50P_0) ; port DAC_D3_P
DAC_D4_N: U11.H15(IO_L51N_0) ; port DAC_D4_N
DAC_D4_P: U11.J15(IO_L51P_0) ; port DAC_D4_P
DAC_D5_N: U11.C18(IO_L52N_0) ; port DAC_D5_N
DAC_D5_P: U11.D18(IO_L52P_0) ; port DAC_D5_P
DAC_D6_N: U11.D19(IO_L54N_0) ; port DAC_D6_N
DAC_D6_P: U11.E19(IO_L54P_0) ; port DAC_D6_P
DAC_D7_N: U11.G17(IO_L55N_0) ; port DAC_D7_N
DAC_D7_P: U11.H16(IO_L55P_0) ; port DAC_D7_P
DAC_DCI_N: U11.C20(IO_L56N_0) ; port DAC_DCI_N
DAC_DCI_P: U11.D21(IO_L56P_0) ; port DAC_DCI_P
DAC_FRAME_N: U11.E18(IO_L57N_0) ; port DAC_FRAME_N
DAC_FRAME_P: U11.F18(IO_L57P_0) ; port DAC_FRAME_P
DAC_IRQ_N: U11.D15(IO_L44N_0) ; port DAC_IRQ_N
DAC_RESET_N: U11.J14(IO_L43P_0) ; port DAC_RESET_N
DAC_SCLK: U11.G14(IO_L43N_0) ; port DAC_SCLK
DAC_SDIO: U11.B16(IO_L38P_0) ; port DAC_SDIO
DAC_TXEN: U11.D16(IO_L46P_0) ; port DAC_TXEN
LED_DEBUG1: U11.C12(IO_L31N_0) ; port LED_DEBUG1
LED_DEBUG3: U11.F13(IO_L33P_0) ; port LED_DEBUG3
PLL_100MHz_N: U11.C14(IO_L36N_GCLK14_0) ; port PLL_100MHz_N
PLL_100MHz_P: U11.D14(IO_L36P_GCLK15_0) ; port PLL_100MHz_P
PLL_SPI_CLK: U11.A4(IO_L2N_0) ; port PLL_SPI_CLK
PLL_SPI_LE: U11.B4(IO_L2P_0) ; port PLL_SPI_LE
PLL_SPI_MISO: U11.E6(IO_L3P_0) ; port PLL_SPI_MISO
PLL_SPI_MOSI: U11.D5(IO_L3N_0) ; port PLL_SPI_MOSI
PLL_SPI_REF_SEL: U11.C5(IO_L4P_0) ; port PLL_SPI_REF_SEL
PLL_SPI_SYNC_N: U11.A5(IO_L4N_0) ; port PLL_SPI_SYNC_N

Not connected (* = marked no-connect by the designer): FID1 1 2; FID2 1 2; FID3 1 2; FID4 1 2; FID5 1 2; FID6 1 2; U11 A2(IO_L1N_VREF_0) A13(IO_L34N_GCLK18_0) A14(IO_L35N_GCLK16_0) A15(IO_L37N_GCLK12_0) A16(IO_L38N_VREF_0) A18(IO_L62N_VREF_0) B14(IO_L35P_GCLK17_0) B18(IO_L62P_0) C8(IO_L14N_0) C13(IO_L34P_GCLK19_0) C15(IO_L37P_GCLK13_0) C16(IO_L46N_0) D8(IO_L14P_0) D12(IO_L31P_0) D13(IO_L33N_0) D20(IO_L58N_0) E8(IO_L13P_0) E20(IO_L58P_0) G8(IO_L5P_0)

### Notes on the sheet
- DAC_SDIO signal:
  Termination even if bi-directional ?
- ALIM FOR BANK 0 ?
- FPGA Trace Lenght:
  Match the lenghts of the DAC / ADC signals LVDS signals.
- FPGA Constraint File:
  Activate diff term for PLL inputs
- FPGA HSWAPEN Pin:
  datasheet - ug380 - p.72
  datasheet - ug380 - p.32
- Heatsink for FPGA:
  datasheet - ug385 - p.347
  THETA_JA = 15C/W
  T_TOT  = T_AMB + THETA_JA * P_FPGA
- TOTAL POWER
  -----------------------
  FPGA_B0: P = V*I = 3.3 * 0.1 = 330mW
  -----------------------
  TOTAL: P = 330mW
- Sheet Name
- Project Title
- Global Project
- Size
- Group
- Revision
- Date
- Sheet
- of
- Filename
- Designers
- (in symbol FPGA_XC6SLX100-3FGG676C, part A) BANK 0

### Library data of the parts
FID1-FID6 = FID_CIRCLE_1MM: FID - FIDUCIAL 1MM CIRCLE DOUBLE-SIDED - 1MM; GRAMS Lib Spec: 2.8; Magnetic Material: NO; Cryo: UNKNOWN; Value: *; Tolerance: *; Voltage Rating: *; Current Rating: *; Power Max: *; HelpURL: https://www.pcb-3d.com/wordpress/wp-content/uploads/ipc-sm-782a_amendment_1_and_2.pdf; CreatedBy/Date: Jonathan Bouchard 2018-07-23; VerifiedBy: Caroline Paulin - 25 juillet 2018; Temperature: *; Package: 1MM CIRCLE; Manufacturer #1: *; Manufacturer #2: *; Note: *; Assembly Type: NONE; Part Number #2: *; Part Number #1: *; Polarized: *; Supplier 1: *; Supplier Part Number 1: *
MTH1-MTH4 = MTH_M3: MTH - MOUNTING HOLE M3 PLATED - M3; GRAMS Lib Spec: 2.8; Magnetic Material: NO; Cryo: UNKNOWN; Value: *; Tolerance: *; Voltage Rating: *; Current Rating: *; Power Max: *; HelpURL: https://littlemachineshop.com/images/gallery/PDF/TapDrillSizes.pdf; CreatedBy/Date: Jonathan Bouchard 2018-07-23; VerifiedBy: Arnaud Samson 23-07-18; Temperature: *; Package: M3; Manufacturer #1: *; Manufacturer #2: *; Note: *; Assembly Type: NONE; Part Number #2: *; Part Number #1: *; Polarized: *; Supplier 1: *; Supplier Part Number 1: *
U11 = FPGA_XC6SLX100-3FGG676C: FPGA - XILINX SPARTAN 6 480 I/O - BGA-676; Voltage: 1.14 V ~ 1.26 V; Current: *; Power: *; Mfg: Xilinx; Mfg Part Number: XC6SLX100-3FGG676C; HelpURL: https://www.xilinx.com/support/documentation/data_sheets/ds162.pdf; CreatedBy: Jonathan Bouchard; Temperature: 0°C ~ 85°C (TJ); Value: *; Precision: *; Package: BGA-676; Supplier 1: Digikey; Supplier Part Number 1: 122-1760-ND
U24 = HEATSINK: HEATSINK 30X30X35MM L-TAB; Value: 3.98degC/W at 100 LFM; GRAMS Lib Spec: 2.7; Note: Top Mount; HelpURL: https://www.qats.com/pushPIN/DataSheet/ATS-P2-146-C1-R0; Supplier 1: Digikey; Supplier Part Number 1: ATS-P2-146-C1-R0-ND; Mfg Part Number: HEATSINK 30X30X35MM L-TAB

## Sheet S7CAS-PLEIADES-CARTE-MERE_P20_FPGA-Unused-Banks.SchDoc
size Tabloid; SheetNumber: 10; SheetTotal: 20; Sheet_Name: FPGA Unused Banks; Size: 11x17
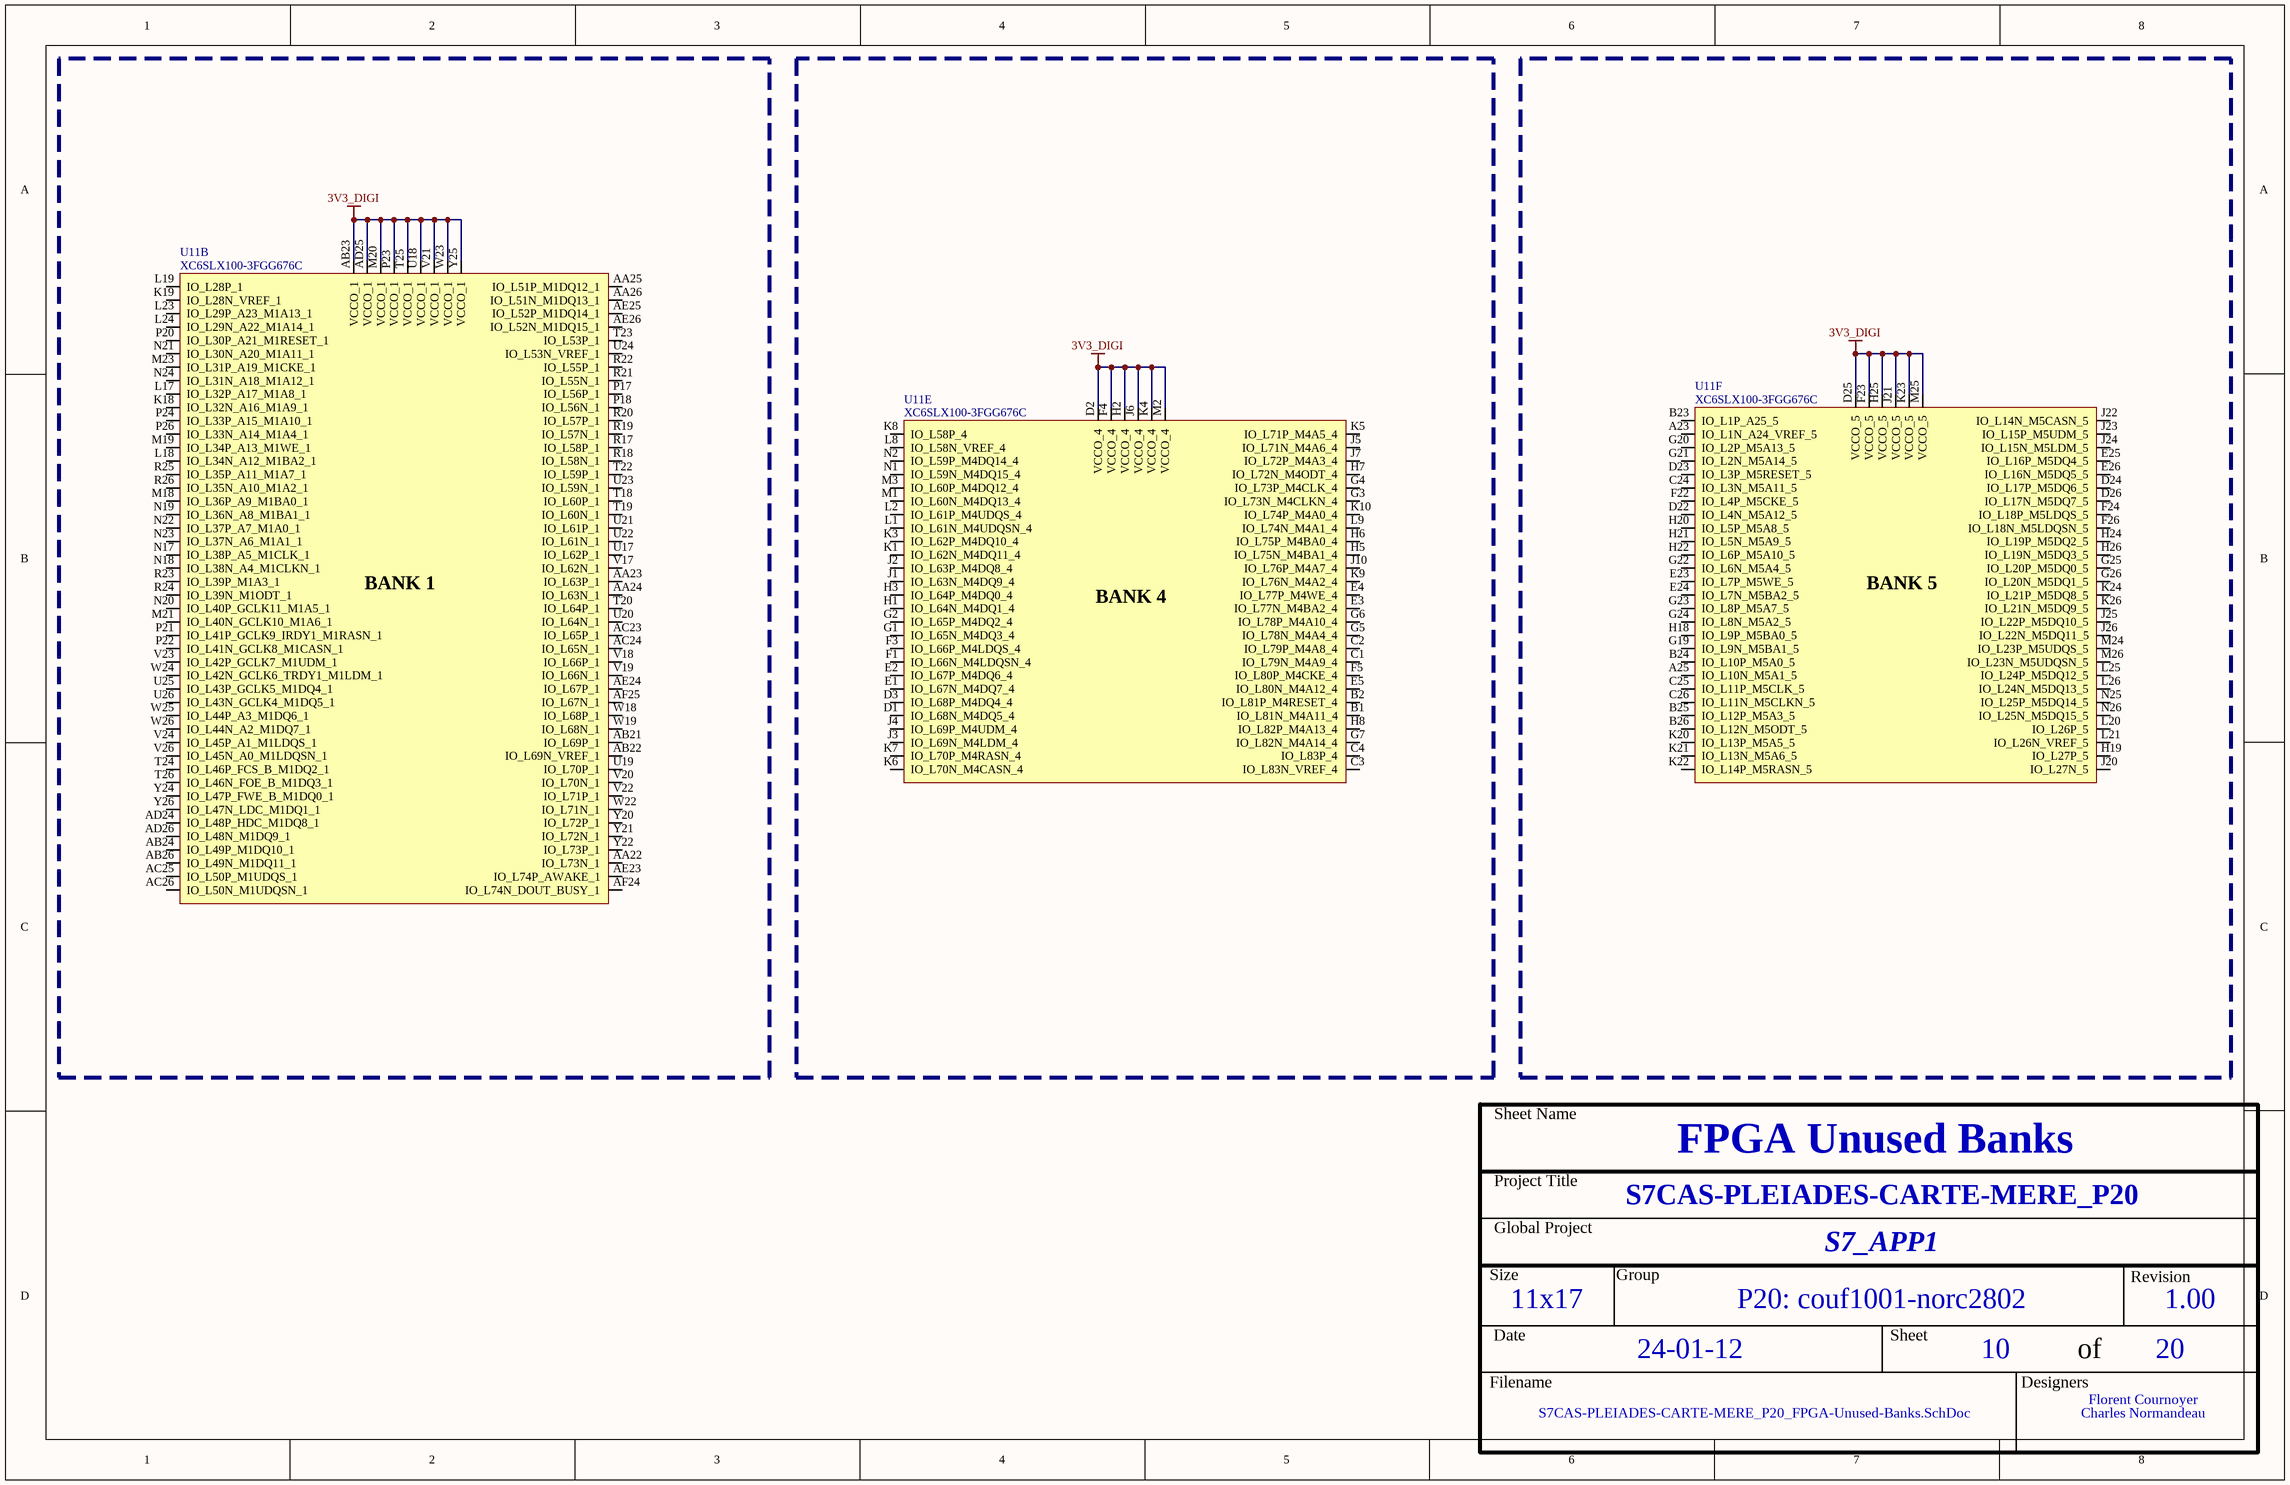
[diagram p9: S7CAS-PLEIADES-CARTE-MERE_P20_FPGA-Unused-Banks.SchDoc]

### Parts
U11  XC6SLX100-3FGG676C  [FPGA_XILINX_FGG676]  (parts B,E,F of 10)

### Nets
3V3_DIGI: U11.AB23(VCCO_1) U11.AD25(VCCO_1) U11.D2(VCCO_4) U11.D25(VCCO_5) U11.F4(VCCO_4) U11.F23(VCCO_5) U11.H2(VCCO_4) U11.H25(VCCO_5) U11.J6(VCCO_4) U11.J21(VCCO_5) U11.K4(VCCO_4) U11.K23(VCCO_5) U11.M2(VCCO_4) U11.M20(VCCO_1) U11.M25(VCCO_5) U11.P23(VCCO_1) U11.T25(VCCO_1) U11.U18(VCCO_1) U11.V21(VCCO_1) U11.W23(VCCO_1) U11.Y25(VCCO_1)

Not connected (* = marked no-connect by the designer): U11 A23(IO_L1N_A24_VREF_5) A25(IO_L10N_M5A1_5) AA22(IO_L73N_1) AA23(IO_L63P_1) AA24(IO_L63N_1) AA25(IO_L51P_M1DQ12_1) AA26(IO_L51N_M1DQ13_1) AB21(IO_L69P_1) AB22(IO_L69N_VREF_1) AB24(IO_L49P_M1DQ10_1) AB26(IO_L49N_M1DQ11_1) AC23(IO_L65P_1) AC24(IO_L65N_1) AC25(IO_L50P_M1UDQS_1) AC26(IO_L50N_M1UDQSN_1) AD24(IO_L48P_HDC_M1DQ8_1) AD26(IO_L48N_M1DQ9_1) AE23(IO_L74P_AWAKE_1) AE24(IO_L67P_1) AE25(IO_L52P_M1DQ14_1) AE26(IO_L52N_M1DQ15_1) AF24(IO_L74N_DOUT_BUSY_1) AF25(IO_L67N_1) B1(IO_L81N_M4A11_4) B2(IO_L81P_M4RESET_4) B23(IO_L1P_A25_5) B24(IO_L10P_M5A0_5) B25(IO_L12P_M5A3_5) B26(IO_L12N_M5ODT_5) C1(IO_L79N_M4A9_4) C2(IO_L79P_M4A8_4) C3(IO_L83N_VREF_4) C4(IO_L83P_4) C24(IO_L3N_M5A11_5) C25(IO_L11P_M5CLK_5) C26(IO_L11N_M5CLKN_5) D1(IO_L68N_M4DQ5_4) D3(IO_L68P_M4DQ4_4) D22(IO_L4N_M5A12_5) D23(IO_L3P_M5RESET_5) D24(IO_L17P_M5DQ6_5) D26(IO_L17N_M5DQ7_5) E1(IO_L67N_M4DQ7_4) E2(IO_L67P_M4DQ6_4) E3(IO_L77N_M4BA2_4) E4(IO_L77P_M4WE_4) E5(IO_L80N_M4A12_4) E23(IO_L7P_M5WE_5) E24(IO_L7N_M5BA2_5) E25(IO_L16P_M5DQ4_5) E26(IO_L16N_M5DQ5_5) F1(IO_L66N_M4LDQSN_4) F3(IO_L66P_M4LDQS_4) F5(IO_L80P_M4CKE_4) F22(IO_L4P_M5CKE_5) F24(IO_L18P_M5LDQS_5) F26(IO_L18N_M5LDQSN_5) G1(IO_L65N_M4DQ3_4) G2(IO_L65P_M4DQ2_4) G3(IO_L73N_M4CLKN_4) G4(IO_L73P_M4CLK_4) G5(IO_L78N_M4A4_4) G6(IO_L78P_M4A10_4) G7(IO_L82N_M4A14_4) G19(IO_L9N_M5BA1_5) G20(IO_L2P_M5A13_5) G21(IO_L2N_M5A14_5) G22(IO_L6N_M5A4_5) G23(IO_L8P_M5A7_5) G24(IO_L8N_M5A2_5) G25(IO_L20P_M5DQ0_5) G26(IO_L20N_M5DQ1_5) H1(IO_L64N_M4DQ1_4) H3(IO_L64P_M4DQ0_4) H5(IO_L75N_M4BA1_4) H6(IO_L75P_M4BA0_4) H7(IO_L72N_M4ODT_4) H8(IO_L82P_M4A13_4) H18(IO_L9P_M5BA0_5) H19(IO_L27P_5) H20(IO_L5P_M5A8_5) H21(IO_L5N_M5A9_5) H22(IO_L6P_M5A10_5) H24(IO_L19P_M5DQ2_5) H26(IO_L19N_M5DQ3_5) J1(IO_L63N_M4DQ9_4) J2(IO_L63P_M4DQ8_4) J3(IO_L69N_M4LDM_4) J4(IO_L69P_M4UDM_4) J5(IO_L71N_M4A6_4) J7(IO_L72P_M4A3_4) J10(IO_L76P_M4A7_4) J20(IO_L27N_5) J22(IO_L14N_M5CASN_5) J23(IO_L15P_M5UDM_5) J24(IO_L15N_M5LDM_5) J25(IO_L22P_M5DQ10_5) J26(IO_L22N_M5DQ11_5) K1(IO_L62N_M4DQ11_4) K3(IO_L62P_M4DQ10_4) K5(IO_L71P_M4A5_4) K6(IO_L70N_M4CASN_4) K7(IO_L70P_M4RASN_4) K8(IO_L58P_4) K9(IO_L76N_M4A2_4) K10(IO_L74P_M4A0_4) K18(IO_L32N_A16_M1A9_1) K19(IO_L28N_VREF_1) K20(IO_L13P_M5A5_5) K21(IO_L13N_M5A6_5) K22(IO_L14P_M5RASN_5) K24(IO_L21P_M5DQ8_5) K26(IO_L21N_M5DQ9_5) L1(IO_L61N_M4UDQSN_4) L2(IO_L61P_M4UDQS_4) L8(IO_L58N_VREF_4) L9(IO_L74N_M4A1_4) L17(IO_L32P_A17_M1A8_1) L18(IO_L34N_A12_M1BA2_1) L19(IO_L28P_1) L20(IO_L26P_5) L21(IO_L26N_VREF_5) L23(IO_L29P_A23_M1A13_1) L24(IO_L29N_A22_M1A14_1) L25(IO_L24P_M5DQ12_5) L26(IO_L24N_M5DQ13_5) M1(IO_L60N_M4DQ13_4) M3(IO_L60P_M4DQ12_4) M18(IO_L36P_A9_M1BA0_1) M19(IO_L34P_A13_M1WE_1) M21(IO_L40N_GCLK10_M1A6_1) M23(IO_L31P_A19_M1CKE_1) M24(IO_L23P_M5UDQS_5) M26(IO_L23N_M5UDQSN_5) N1(IO_L59N_M4DQ15_4) N2(IO_L59P_M4DQ14_4) N17(IO_L38P_A5_M1CLK_1) N18(IO_L38N_A4_M1CLKN_1) N19(IO_L36N_A8_M1BA1_1) N20(IO_L40P_GCLK11_M1A5_1) N21(IO_L30N_A20_M1A11_1) N22(IO_L37P_A7_M1A0_1) N23(IO_L37N_A6_M1A1_1) N24(IO_L31N_A18_M1A12_1) N25(IO_L25P_M5DQ14_5) N26(IO_L25N_M5DQ15_5) P17(IO_L56P_1) P18(IO_L56N_1) P20(IO_L30P_A21_M1RESET_1) P21(IO_L41P_GCLK9_IRDY1_M1RASN_1) P22(IO_L41N_GCLK8_M1CASN_1) P24(IO_L33P_A15_M1A10_1) P26(IO_L33N_A14_M1A4_1) R17(IO_L58P_1) R18(IO_L58N_1) R19(IO_L57N_1) R20(IO_L57P_1) R21(IO_L55N_1) R22(IO_L55P_1) R23(IO_L39P_M1A3_1) R24(IO_L39N_M1ODT_1) R25(IO_L35P_A11_M1A7_1) R26(IO_L35N_A10_M1A2_1) T18(IO_L60P_1) T19(IO_L60N_1) T20(IO_L64P_1) T22(IO_L59P_1) T23(IO_L53P_1) T24(IO_L46P_FCS_B_M1DQ2_1) T26(IO_L46N_FOE_B_M1DQ3_1) U17(IO_L62P_1) U19(IO_L70P_1) U20(IO_L64N_1) U21(IO_L61P_1) U22(IO_L61N_1) U23(IO_L59N_1) U24(IO_L53N_VREF_1) U25(IO_L43P_GCLK5_M1DQ4_1) U26(IO_L43N_GCLK4_M1DQ5_1) V17(IO_L62N_1) V18(IO_L66P_1) V19(IO_L66N_1) V20(IO_L70N_1) V22(IO_L71P_1) V23(IO_L42P_GCLK7_M1UDM_1) V24(IO_L45P_A1_M1LDQS_1) V26(IO_L45N_A0_M1LDQSN_1) W18(IO_L68P_1) W19(IO_L68N_1) W22(IO_L71N_1) W24(IO_L42N_GCLK6_TRDY1_M1LDM_1) W25(IO_L44P_A3_M1DQ6_1) W26(IO_L44N_A2_M1DQ7_1) Y20(IO_L72P_1) Y21(IO_L72N_1) Y22(IO_L73P_1) Y24(IO_L47P_FWE_B_M1DQ0_1) Y26(IO_L47N_LDC_M1DQ1_1)

### Notes on the sheet
- Sheet Name
- Project Title
- Global Project
- Size
- Group
- Revision
- Date
- Sheet
- of
- Filename
- Designers
- (in symbol FPGA_XC6SLX100-3FGG676C, part B) BANK 1
- (in symbol FPGA_XC6SLX100-3FGG676C, part E) BANK 4
- (in symbol FPGA_XC6SLX100-3FGG676C, part F) BANK 5

### Library data of the parts
U11 = FPGA_XC6SLX100-3FGG676C: as U11 on sheet S7CAS-PLEIADES-CARTE-MERE_P20_Mechanical-FPGA-Bank-0; Current: *; Power: *; Mfg: Xilinx; Mfg Part Number: XC6SLX100-3FGG676C; HelpURL: https://www.xilinx.com/support/documentation/data_sheets/ds162.pdf; CreatedBy: Jonathan Bouchard; Temperature: 0°C ~ 85°C (TJ); Value: *; Precision: *; Package: BGA-676; Supplier 1: Digikey; Supplier Part Number 1: 122-1760-ND

## Sheet S7CAS-PLEIADES-CARTE-MERE_P20_FPGA-Decoupling.SchDoc
size Tabloid; SheetNumber: 11; SheetTotal: 20; Sheet_Name: FPGA Decoupling; Size: 11x17
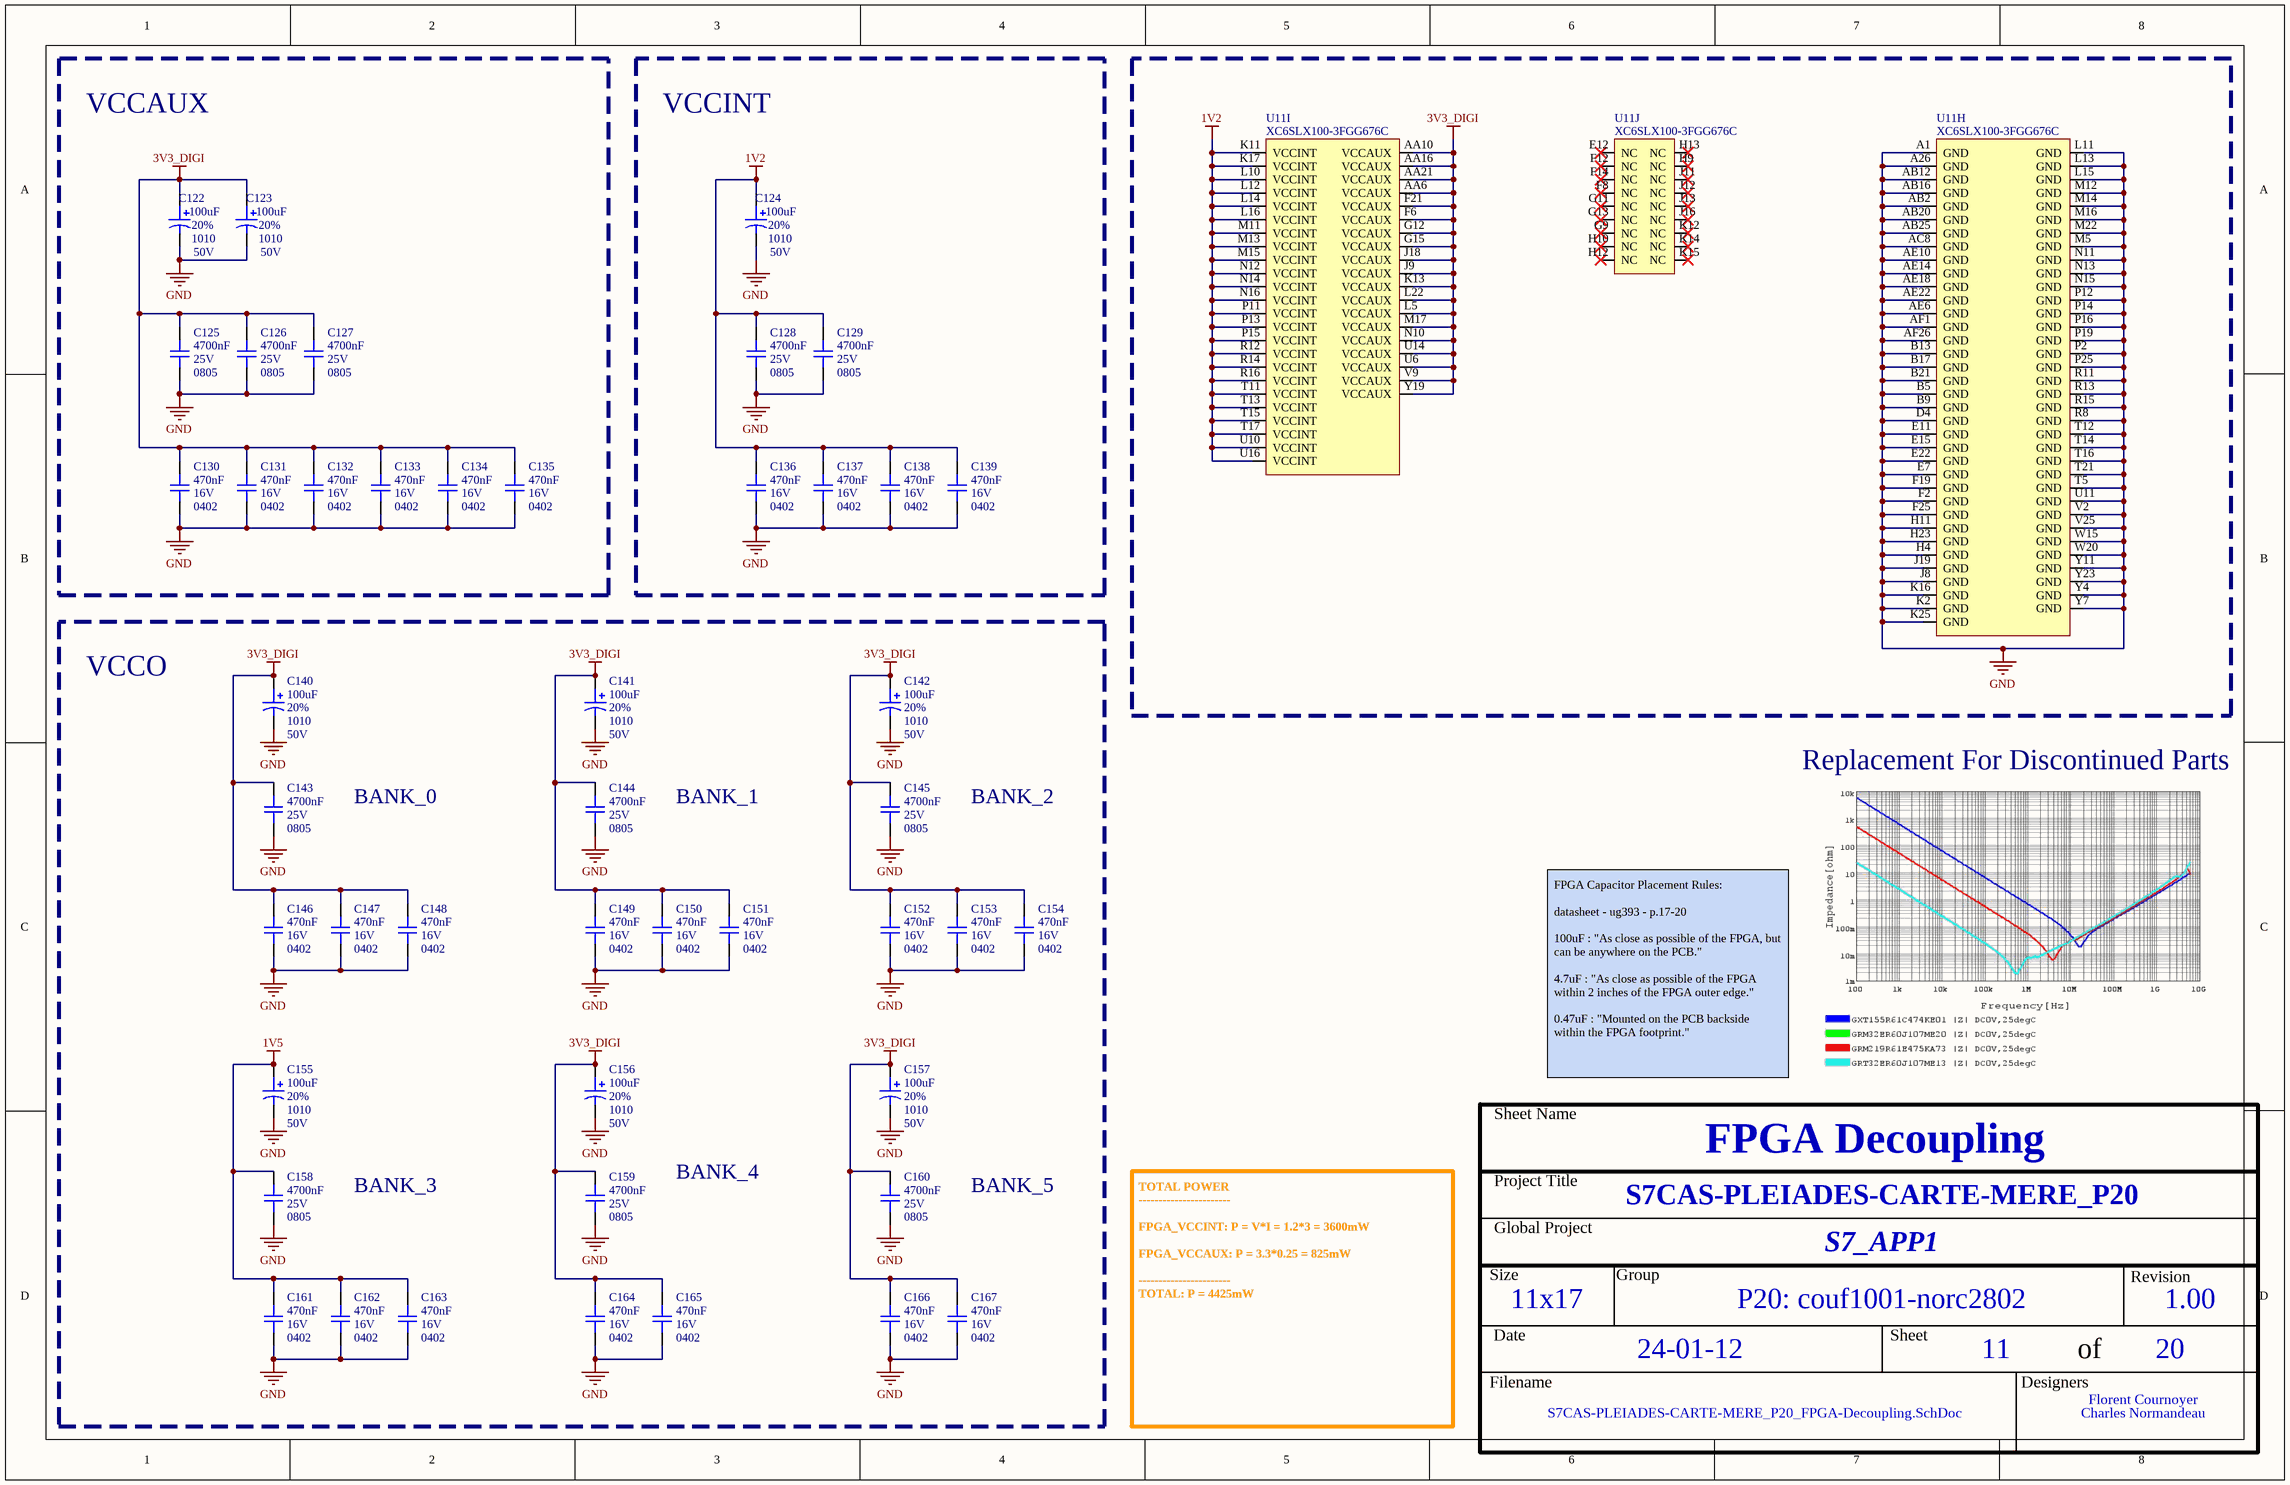
[diagram p10: S7CAS-PLEIADES-CARTE-MERE_P20_FPGA-Decoupling.SchDoc]

### Parts
C122  value 100uF  Voltage: 50V  Package: 1010  Precision: 20%  [CAP_ALU_1010_vishay]  (hidden comment: MAL215099101E3)
C123  value 100uF  Voltage: 50V  Package: 1010  Precision: 20%  [CAP_ALU_1010_vishay]  (hidden comment: MAL215099101E3)
C124  value 100uF  Voltage: 50V  Package: 1010  Precision: 20%  [CAP_ALU_1010_vishay]  (hidden comment: MAL215099101E3)
C125  value 4700nF  Voltage: 25V  Package: 0805  [CAP_0805]  (hidden comment: CAP - 0805)
C126  value 4700nF  Voltage: 25V  Package: 0805  [CAP_0805]  (hidden comment: CAP - 0805)
C127  value 4700nF  Voltage: 25V  Package: 0805  [CAP_0805]  (hidden comment: CAP - 0805)
C128  value 4700nF  Voltage: 25V  Package: 0805  [CAP_0805]  (hidden comment: CAP - 0805)
C129  value 4700nF  Voltage: 25V  Package: 0805  [CAP_0805]  (hidden comment: CAP - 0805)
C130  value 470nF  Voltage: 16V  Package: 0402  [CAP_0402]  (hidden comment: CAP - 0402)
C131  value 470nF  Voltage: 16V  Package: 0402  [CAP_0402]  (hidden comment: CAP - 0402)
C132  value 470nF  Voltage: 16V  Package: 0402  [CAP_0402]  (hidden comment: CAP - 0402)
C133  value 470nF  Voltage: 16V  Package: 0402  [CAP_0402]  (hidden comment: CAP - 0402)
C134  value 470nF  Voltage: 16V  Package: 0402  [CAP_0402]  (hidden comment: CAP - 0402)
C135  value 470nF  Voltage: 16V  Package: 0402  [CAP_0402]  (hidden comment: CAP - 0402)
C136  value 470nF  Voltage: 16V  Package: 0402  [CAP_0402]  (hidden comment: CAP - 0402)
C137  value 470nF  Voltage: 16V  Package: 0402  [CAP_0402]  (hidden comment: CAP - 0402)
C138  value 470nF  Voltage: 16V  Package: 0402  [CAP_0402]  (hidden comment: CAP - 0402)
C139  value 470nF  Voltage: 16V  Package: 0402  [CAP_0402]  (hidden comment: CAP - 0402)
C140  value 100uF  Voltage: 50V  Package: 1010  Precision: 20%  [CAP_ALU_1010_vishay]  (hidden comment: MAL215099101E3)
C141  value 100uF  Voltage: 50V  Package: 1010  Precision: 20%  [CAP_ALU_1010_vishay]  (hidden comment: MAL215099101E3)
C142  value 100uF  Voltage: 50V  Package: 1010  Precision: 20%  [CAP_ALU_1010_vishay]  (hidden comment: MAL215099101E3)
C143  value 4700nF  Voltage: 25V  Package: 0805  [CAP_0805]  (hidden comment: CAP - 0805)
C144  value 4700nF  Voltage: 25V  Package: 0805  [CAP_0805]  (hidden comment: CAP - 0805)
C145  value 4700nF  Voltage: 25V  Package: 0805  [CAP_0805]  (hidden comment: CAP - 0805)
C146  value 470nF  Voltage: 16V  Package: 0402  [CAP_0402]  (hidden comment: CAP - 0402)
C147  value 470nF  Voltage: 16V  Package: 0402  [CAP_0402]  (hidden comment: CAP - 0402)
C148  value 470nF  Voltage: 16V  Package: 0402  [CAP_0402]  (hidden comment: CAP - 0402)
C149  value 470nF  Voltage: 16V  Package: 0402  [CAP_0402]  (hidden comment: CAP - 0402)
C150  value 470nF  Voltage: 16V  Package: 0402  [CAP_0402]  (hidden comment: CAP - 0402)
C151  value 470nF  Voltage: 16V  Package: 0402  [CAP_0402]  (hidden comment: CAP - 0402)
C152  value 470nF  Voltage: 16V  Package: 0402  [CAP_0402]  (hidden comment: CAP - 0402)
C153  value 470nF  Voltage: 16V  Package: 0402  [CAP_0402]  (hidden comment: CAP - 0402)
C154  value 470nF  Voltage: 16V  Package: 0402  [CAP_0402]  (hidden comment: CAP - 0402)
C155  value 100uF  Voltage: 50V  Package: 1010  Precision: 20%  [CAP_ALU_1010_vishay]  (hidden comment: MAL215099101E3)
C156  value 100uF  Voltage: 50V  Package: 1010  Precision: 20%  [CAP_ALU_1010_vishay]  (hidden comment: MAL215099101E3)
C157  value 100uF  Voltage: 50V  Package: 1010  Precision: 20%  [CAP_ALU_1010_vishay]  (hidden comment: MAL215099101E3)
C158  value 4700nF  Voltage: 25V  Package: 0805  [CAP_0805]  (hidden comment: CAP - 0805)
C159  value 4700nF  Voltage: 25V  Package: 0805  [CAP_0805]  (hidden comment: CAP - 0805)
C160  value 4700nF  Voltage: 25V  Package: 0805  [CAP_0805]  (hidden comment: CAP - 0805)
C161  value 470nF  Voltage: 16V  Package: 0402  [CAP_0402]  (hidden comment: CAP - 0402)
C162  value 470nF  Voltage: 16V  Package: 0402  [CAP_0402]  (hidden comment: CAP - 0402)
C163  value 470nF  Voltage: 16V  Package: 0402  [CAP_0402]  (hidden comment: CAP - 0402)
C164  value 470nF  Voltage: 16V  Package: 0402  [CAP_0402]  (hidden comment: CAP - 0402)
C165  value 470nF  Voltage: 16V  Package: 0402  [CAP_0402]  (hidden comment: CAP - 0402)
C166  value 470nF  Voltage: 16V  Package: 0402  [CAP_0402]  (hidden comment: CAP - 0402)
C167  value 470nF  Voltage: 16V  Package: 0402  [CAP_0402]  (hidden comment: CAP - 0402)
U11  XC6SLX100-3FGG676C  [FPGA_XILINX_FGG676]  (parts H,I,J of 10)

### Blocks framed on the sheet
VCCAUX: C122 C123 C125-C127 C130-C135
VCCINT: C124 C128 C129 C136-C139
VCCO: C140-C167

### Nets
1V2: C124.1 C128.2 C129.2 C136.2 C137.2 C138.2 C139.2 U11.K11(VCCINT) U11.K17(VCCINT) U11.L10(VCCINT) U11.L12(VCCINT) U11.L14(VCCINT) U11.L16(VCCINT) U11.M11(VCCINT) U11.M13(VCCINT) U11.M15(VCCINT) U11.N12(VCCINT) U11.N14(VCCINT) U11.N16(VCCINT) U11.P11(VCCINT) U11.P13(VCCINT) U11.P15(VCCINT) U11.R12(VCCINT) U11.R14(VCCINT) U11.R16(VCCINT) U11.T11(VCCINT) U11.T13(VCCINT) U11.T15(VCCINT) U11.T17(VCCINT) U11.U10(VCCINT) U11.U16(VCCINT)
1V5: C155.1 C158.2 C161.2 C162.2 C163.2
3V3_DIGI: C122.1 C123.1 C125.2 C126.2 C127.2 C130.2 C131.2 C132.2 C133.2 C134.2 C135.2 C140.1 C141.1 C142.1 C143.2 C144.2 C145.2 C146.2 C147.2 C148.2 C149.2 C150.2 C151.2 C152.2 C153.2 C154.2 C156.1 C157.1 C159.2 C160.2 C164.2 C165.2 C166.2 C167.2 U11.AA6(VCCAUX) U11.AA10(VCCAUX) U11.AA16(VCCAUX) U11.AA21(VCCAUX) U11.F6(VCCAUX) U11.F21(VCCAUX) U11.G12(VCCAUX) U11.G15(VCCAUX) U11.J9(VCCAUX) U11.J18(VCCAUX) U11.K13(VCCAUX) U11.L5(VCCAUX) U11.L22(VCCAUX) U11.M17(VCCAUX) U11.N10(VCCAUX) U11.U6(VCCAUX) U11.U14(VCCAUX) U11.V9(VCCAUX) U11.Y19(VCCAUX)
GND: C122.2 C123.2 C124.2 C125.1 C126.1 C127.1 C128.1 C129.1 C130.1 C131.1 C132.1 C133.1 C134.1 C135.1 C136.1 C137.1 C138.1 C139.1 C140.2 C141.2 C142.2 C143.1 C144.1 C145.1 C146.1 C147.1 C148.1 C149.1 C150.1 C151.1 C152.1 C153.1 C154.1 C155.2 C156.2 C157.2 C158.1 C159.1 C160.1 C161.1 C162.1 C163.1 C164.1 C165.1 C166.1 C167.1 U11.A1(GND) U11.A26(GND) U11.AB2(GND) U11.AB12(GND) U11.AB16(GND) U11.AB20(GND) U11.AB25(GND) U11.AC8(GND) U11.AE6(GND) U11.AE10(GND) U11.AE14(GND) U11.AE18(GND) U11.AE22(GND) U11.AF1(GND) U11.AF26(GND) U11.B5(GND) U11.B9(GND) U11.B13(GND) U11.B17(GND) U11.B21(GND) U11.D4(GND) U11.E7(GND) U11.E11(GND) U11.E15(GND) U11.E22(GND) U11.F2(GND) U11.F19(GND) U11.F25(GND) U11.H4(GND) U11.H11(GND) U11.H23(GND) U11.J8(GND) U11.J19(GND) U11.K2(GND) U11.K16(GND) U11.K25(GND) U11.L11(GND) U11.L13(GND) U11.L15(GND) U11.M5(GND) U11.M12(GND) U11.M14(GND) U11.M16(GND) U11.M22(GND) U11.N11(GND) U11.N13(GND) U11.N15(GND) U11.P2(GND) U11.P12(GND) U11.P14(GND) U11.P16(GND) U11.P19(GND) U11.P25(GND) U11.R8(GND) U11.R11(GND) U11.R13(GND) U11.R15(GND) U11.T5(GND) U11.T12(GND) U11.T14(GND) U11.T16(GND) U11.T21(GND) U11.U11(GND) U11.V2(GND) U11.V25(GND) U11.W15(GND) U11.W20(GND) U11.Y4(GND) U11.Y7(GND) U11.Y11(GND) U11.Y23(GND)

Not connected (* = marked no-connect by the designer): U11 E12(NC)* F8(NC)* F12(NC)* F14(NC)* G9(NC)* G11(NC)* G13(NC)* H9(NC)* H10(NC)* H12(NC)* H13(NC)* J11(NC)* J12(NC)* J13(NC)* J16(NC)* K12(NC)* K14(NC)* K15(NC)*

### Notes on the sheet
- Replacement For Discontinued Parts
- BANK_0
- BANK_1
- BANK_2
- FPGA Capacitor Placement Rules:
  datasheet - ug393 - p.17-20
  100uF : "As close as possible of the FPGA, but can be anywhere on the PCB."
  4.7uF : "As close as possible of the FPGA within 2 inches of the FPGA outer edge."
  0.47uF : "Mounted on the PCB backside within the FPGA footprint."
- BANK_3
- BANK_4
- BANK_5
- TOTAL POWER
  -----------------------
  FPGA_VCCINT: P = V*I = 1.2*3 = 3600mW
  FPGA_VCCAUX: P = 3.3*0.25 = 825mW
  -----------------------
  TOTAL: P = 4425mW
- Sheet Name
- Project Title
- Global Project
- Size
- Group
- Revision
- Date
- Sheet
- of
- Filename
- Designers

### Library data of the parts
C122-C124 C140-C142 C155-C157 = CAP_ALU_MAL215099101E3: CAP - ALU 100uF 20% 50V - 1010; Current: 490mA; Mfg: Vishay Dale; Mfg Part Number: MAL215099101E3; HelpURL: http://www.vishay.com/docs/28395/150crz.pdf; CreatedBy: Jonathan Bouchard; Temperature: -55°C to 125°C; Power: *; Supplier 1: Digikey; Supplier Part Number 1: 4399PHDKR-ND
C125-C129 C143-C145 C158-C160 = CAP - 0805: Mfg Part Number: GRM219R61E475KA73; Precision: 10%; Current: *; CreatedBy: Jonathan Bouchard; Power: *
C130-C139 C146-C154 C161-C167 = CAP - 0402: Mfg Part Number: GXT155R61C474KE01; Precision: 10%; Current: *; CreatedBy: Jonathan Bouchard; Power: *
U11 = FPGA_XC6SLX100-3FGG676C: as U11 on sheet S7CAS-PLEIADES-CARTE-MERE_P20_Mechanical-FPGA-Bank-0; Current: *; Power: *; Mfg: Xilinx; Mfg Part Number: XC6SLX100-3FGG676C; HelpURL: https://www.xilinx.com/support/documentation/data_sheets/ds162.pdf; CreatedBy: Jonathan Bouchard; Temperature: 0°C ~ 85°C (TJ); Value: *; Precision: *; Package: BGA-676; Supplier 1: Digikey; Supplier Part Number 1: 122-1760-ND